# EAGLE schematic BEP32_6stencil_Seed_wMilling (EAGLE 6.4), part 2 of 4
## Sheet 5 of 12
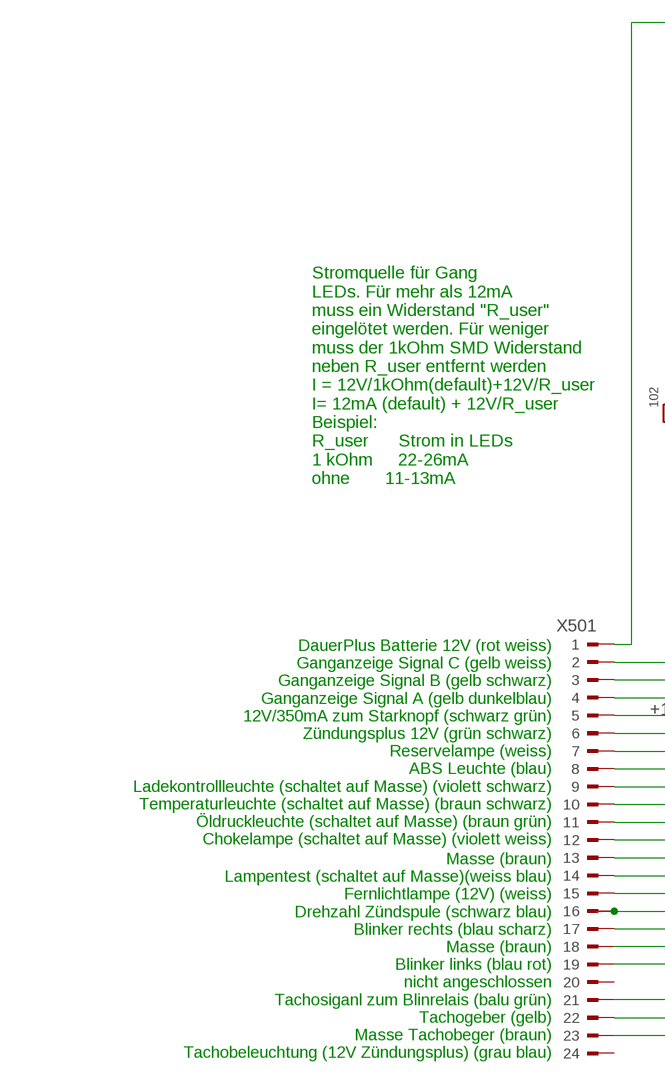
[diagram p8: schematic, sheet 5, part 1 of 2]
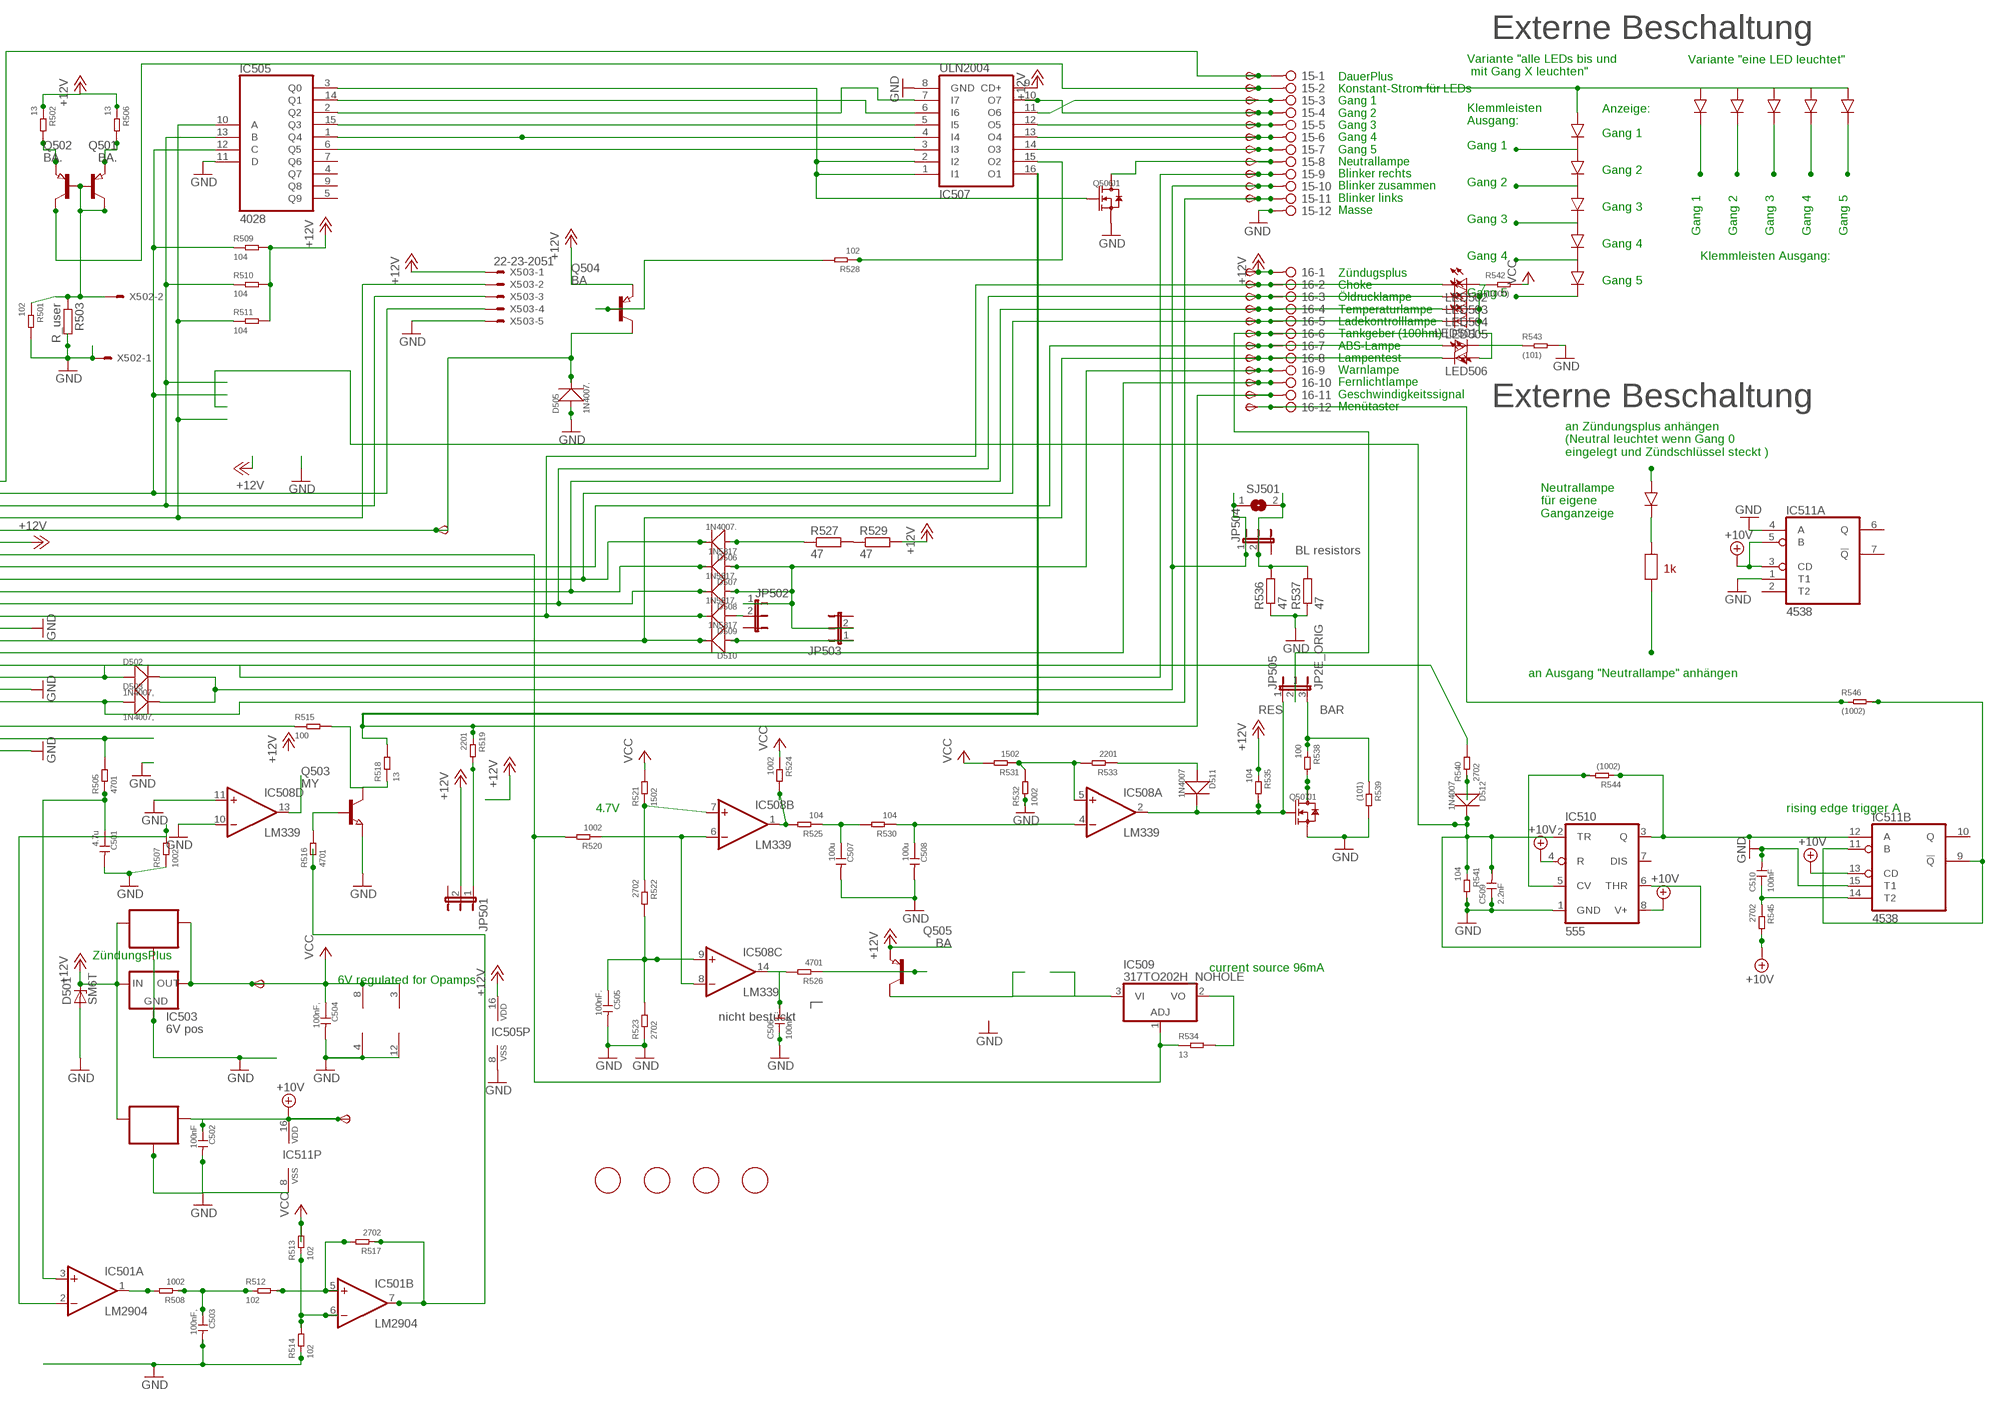
[diagram p9: schematic, sheet 5, part 2 of 2]

### Parts
6V501  TPSB2.0  [B2.0]
10V501  TPSB2.0  [B2.0]
15  2081-1132  [12-PIN]
16  2081-1132  [12-PIN]
C501  4.7u  CERAMIC-4.7UF-25V-10%-X5R(0805)  [C0805]
C502  100nF  CERAMIC-100NF-50V-10%-X7R(0805)  [C0805]
C503  100nF,  CERAMIC-100NF-50V-10%-X7R(0805)  [C0805]
C504  100nF,  CERAMIC-100NF-50V-10%-X7R(0805)  [C0805]
C505  100nF.  CERAMIC-100NF-50V-10%-X7R(0805)  [C0805]
C506  100nF.  CERAMIC-100NF-50V-10%-X7R(0805)  [C0805]
C507  100u  CERAMIC-100UF-6.3V-20%-X5R(1206)  [C1206]
C508  100u  CERAMIC-100UF-6.3V-20%-X5R(1206)  [C1206]
C509  2.2nF  CERAMIC-100NF-50V-10%-X7R(0805)  [C0805]
C510  100nF  CERAMIC-100NF-50V-10%-X7R(0805)  [C0805]
D501  SM6T  [DO214AA]
D502  1N4007,  DIODE-GEN-PURPOSE-1KV-1A(DO-214AC)  [DO-214AC]
D503  1N4007,  DIODE-GEN-PURPOSE-1KV-1A(DO-214AC)  [DO-214AC]
D505  1N4007.  DIODE-GEN-PURPOSE-1KV-1A(DO-214AC)  [DO-214AC]
D506  1N4007.  DIODE-GEN-PURPOSE-1KV-1A(DO-214AC)  [DO-214AC]
D507  1N5817  DIODE-GEN-PURPOSE-1KV-1A(DO-214AC)DO-214AC/1206  [DO-214AC_SLIM]
D508  1N5817.  DIODE-GEN-PURPOSE-1KV-1A(DO-214AC)DO-214AC/1206  [DO-214AC_SLIM]
D509  1N5817.  DIODE-GEN-PURPOSE-1KV-1A(DO-214AC)DO-214AC/1206  [DO-214AC_SLIM]
D510  1N5817  DIODE-GEN-PURPOSE-1KV-1A(DO-214AC)DO-214AC/1206  [DO-214AC_SLIM]
D511  1N4007  DIODE-GEN-PURPOSE-1KV-1A(DO-214AC)  [DO-214AC]
D512  1N4007  DIODE-GEN-PURPOSE-1KV-1A(DO-214AC)  [DO-214AC]
FID501  FIDUCIAL  [FIDUCIAL_1MM]
FID502  FIDUCIAL  [FIDUCIAL_1MM]
FID503  FIDUCIAL  [FIDUCIAL_1MM]
FID504  FIDUCIAL  [FIDUCIAL_1MM]
IC501  LM2904  LM358D  [SO08]
IC502  78L06  78LXXSOT89_ROUND  [SOT89_ROUND]
IC503  6V pos  78LXX  [78LXX]
IC504  78L10  78LXXSOT89_ROUND  [SOT89_ROUND]
IC505  4028  4028D  [SO16]
IC507  ULN2004  ULN2004AD  [SO16]
IC508  LM339  LM339D  [SO14]
IC509  317TO202H_NOHOLE  [TO220H_NOHOLE]
IC510  555  NE555D  [SO08]
IC511  4538  4538D  [SO16]
JP501  JP2EJP2_SMALLPADS  [JP2_SMALLPADS]
JP502  JP2EJP2_SMALLPADS  [JP2_SMALLPADS]
JP503  JP2EJP2_SMALLPADS  [JP2_SMALLPADS]
JP504  JP2EJP2_SMALLPADS  [JP2_SMALLPADS]
JP505  JP2E_ORIG  [JP2_ORIG_SMALLPADS]
LED501  LEDLD260  [LD260]
LED502  LEDLD260  [LD260]
LED503  LEDLD260  [LD260]
LED504  LEDLD260  [LD260]
LED505  LEDLD260  [LD260]
LED506  LEDLD260  [LD260]
Q501  BA.  PNP-TRANSISTOR_SOT89  [SOT89]
Q502  BA.  PNP-TRANSISTOR_SOT89  [SOT89]
Q503  MY  NPN-TRANSISTOR_SOT89  [SOT89]
Q504  BA  PNP-TRANSISTOR_SOT89  [SOT89]
Q505  BA  PNP-TRANSISTOR_SOT89  [SOT89]
Q506  J1  SMD-MOSFET-N-CH-50V-200MA-BSS138W-7-F(SOT-23)  [SOT-23]
Q507  J1  SMD-MOSFET-N-CH-50V-200MA-BSS138W-7-F(SOT-23)  [SOT-23]
R501  102  SMD-RES-1K-5%-1/8W(0805)  [R0805]
R502  13  SMD-RES-13R-5%-1/4W(1206)  [R1206]
R503  R_user  R-EU_R0805  [R0805]
R505  4701  SMD-RES-4.7K-5%-1/8W(0805)  [R0805]
R506  13  SMD-RES-13R-5%-1/4W(1206)  [R1206]
R507  1002  SMD-RES-10K-1%-1/8W(0805)  [R0805]
R508  1002  SMD-RES-10K-1%-1/8W(0805)  [R0805]
R509  104  SMD-RES-10K-1%-1/8W(0805)  [R0805]
R510  104  SMD-RES-10K-1%-1/8W(0805)  [R0805]
R511  104  SMD-RES-10K-1%-1/8W(0805)  [R0805]
R512  102  SMD-RES-1K-5%-1/8W(0805)  [R0805]
R513  102  SMD-RES-1K-5%-1/8W(0805)  [R0805]
R514  102  SMD-RES-1K-5%-1/8W(0805)  [R0805]
R515  100  SMD-RES-220R-5%-1/8W(0805)  [R0805]
R516  4701  SMD-RES-4.7K-5%-1/8W(0805)  [R0805]
R517  2702  SMD-RES-4.7K-5%-1/8W(0805)  [R0805]
R518  13  SMD-RES-13R-5%-1/4W(1206)  [R1206]
R519  2201  SMD-RES-2.2K-5%-1/8W(0805)  [R0805]
R520  1002  SMD-RES-10K-1%-1/8W(0805)  [R0805]
R521  1502  SMD-RES-10K-1%-1/8W(0805)  [R0805]
R522  2702  SMD-RES-4.7K-5%-1/8W(0805)  [R0805]
R523  2702  SMD-RES-4.7K-5%-1/8W(0805)  [R0805]
R524  1002  SMD-RES-10K-1%-1/8W(0805)  [R0805]
R525  104  SMD-RES-10K-1%-1/8W(0805)  [R0805]
R526  4701  SMD-RES-4.7K-5%-1/8W(0805)  [R0805]
R527  47  R-EU_V235/17_1MM  [V235/17_1MM]
R528  102  SMD-RES-1K-5%-1/8W(0805)  [R0805]
R529  47  R-EU_V235/17_1MM  [V235/17_1MM]
R530  104  SMD-RES-10K-1%-1/8W(0805)  [R0805]
R531  1502  SMD-RES-10K-1%-1/8W(0805)  [R0805]
R532  1002  SMD-RES-10K-1%-1/8W(0805)  [R0805]
R533  2201  SMD-RES-2.2K-5%-1/8W(0805)  [R0805]
R534  13  SMD-RES-13R-5%-1/4W(1206)  [R1206]
R535  104  SMD-RES-10K-1%-1/8W(0805)  [R0805]
R536  47  R-EU_V235/17_1MM  [V235/17_1MM]
R537  47  R-EU_V235/17_1MM  [V235/17_1MM]
R538  100  SMD-RES-2.2K-5%-1/8W(0805)  [R0805]
R539  (101)  SMD-RES-2.2K-5%-1/8W(0805)  [R0805]
R540  2702  SMD-RES-10K-1%-1/8W(0805)  [R0805]
R541  104  SMD-RES-10K-1%-1/8W(0805)  [R0805]
R542  (1000)  SMD-RES-100R-5%-1/8W(0805)  [R0805]
R543  (101)  SMD-RES-100R-5%-1/8W(0805)  [R0805]
R544  (1002)  SMD-RES-10K-1%-1/8W(0805)  [R0805]
R545  2702  SMD-RES-4.7K-5%-1/8W(0805)  [R0805]
R546  (1002)  SMD-RES-4.7K-5%-1/8W(0805)  [R0805]
SJ501  SJ  [SJ]
START501  TPSB2.0  [B2.0]
TP162  TPSB2.0  [B2.0]
TP163  TPSB2.0  [B2.0]
TP164  TPSB2.0  [B2.0]
TP165  TPSB2.0  [B2.0]
TP166  TPSB2.0  [B2.0]
TP167  TPSB2.0  [B2.0]
TP168  TPSB2.0  [B2.0]
TP169  TPSB2.0  [B2.0]
TP170  TPSB2.0  [B2.0]
TP171  TPSB2.0  [B2.0]
TP172  TPSB2.0  [B2.0]
TP173  TPSB2.0  [B2.0]
TP174  TPSB2.0  [B2.0]
TP175  TPSB2.0  [B2.0]
TP176  TPSB2.0  [B2.0]
TP177  TPSB2.0  [B2.0]
TP178  TPSB2.0  [B2.0]
TP179  TPSB2.0  [B2.0]
TP180  TPSB1,27  [B1,27]
TP181  TPSB2.0  [B2.0]
TP182  TPSB2.0  [B2.0]
TP183  TPSB2.0  [B2.0]
TP184  TPSB2.0  [B2.0]
X501  CON_BMWV2  [24-PIN_V2]
X502  22-23-2021  [22-23-2021]
X503  22-23-2051  [22-23-2051]

### Nets
+10V: 10V501.TP(PP) C502.1 IC504.1(OUT) IC510.4(R) IC510.8(V+) IC511.3(A:CD) IC511.5(A:B) IC511.13(B:CD) IC511.16(P:VDD) R545.2 ; also sheet 1,2,3,4,6,7,8,9,10,11,12
+12V: 16.1 D501.C IC502.3(IN) IC503.IN IC504.3(IN) IC505.16(VDD) IC507.9(CD+) JP501.2 Q504.3(E) Q505.3(E) R502.1 R506.1 R509.2 R510.2 R511.2 R529.2 R535.1 TP183.TP(PP) X501.6 X503.1 ; also sheet 1,2,3,4,6,7,8,9,10,11,12
+12V8: IC501.7(B:OUT) R516.1 R517.1
GND: 15.12 C501.2 C502.2 C503.2 C504.2 C505.2 C506.1 C507.2 C508.2 C509.1 C510.2 D501.A D505.1(+) IC501.4(P:V-) IC502.2(GND) IC502.2@1(GND) IC503.GND IC504.2(GND) IC504.2@1(GND) IC505.8(VSS) IC505.11(D) IC507.8(GND) IC508.10(D:-IN) IC508.11(D:+IN) IC508.12(P:GND) IC510.1(GND) IC511.1(A:T1) IC511.4(A:A) IC511.8(P:VSS) IC511.15(B:T1) Q503.3(E) Q506.2(S) Q507.2(S) R501.2 R503.2 R507.1 R514.1 R523.1 R532.1 R536.1 R537.1 R539.2 R541.2 R543.2 X501.13 X501.18 X501.23 X502.1 X503.5 ; also sheet 1,2,3,4,6,7,8,9,10,11,12
N$687: R527.2 R529.1
N$688: 16.9 D507.1(+) D508.1(+) JP502.1 JP503.2 TP180.TP(PP)
N$689: IC505.10(A) R511.1 X501.4 X503.2
N$690: IC505.13(B) R510.1 X501.3 X503.3
N$691: D505.2(-) Q504.2(C) START501.TP(PP) X501.5
N$692: IC505.12(C) R509.1 X501.2 X503.4
N$693: 16.7 LED501.A TP178.TP(PP) X501.8
N$694: 16.2 D509.2(-) LED502.K(C) TP173.TP(PP) X501.12
N$695: 16.3 D508.2(-) LED503.K(C) TP174.TP(PP) X501.11
N$696: 16.4 D507.2(-) LED504.K(C) TP175.TP(PP) X501.10
N$697: 16.8 D510.2(-) LED506.K(C) TP179.TP(PP) X501.14
N$698: 15.9 D502.1(+) TP170.TP(PP) X501.17
N$699: 15.11 D503.1(+) TP172.TP(PP) X501.19
N$700: R505.2 X501.22
N$701: C501.1 IC501.3(A:+IN) R505.1
N$702: 16.11 IC507.16(O1) R518.2 R519.1 TP182.TP(PP)
N$703: IC508.1(B:OUT) R524.2 R525.2
N$704: C507.1 R525.1 R530.2
N$705: C508.1 IC508.4(A:-IN) R530.1
N$706: IC508.5(A:+IN) R531.1 R532.2 R533.2
N$707: D511.1(+) R533.1
N$708: C505.1 IC508.9(C:+IN) R522.2 R523.2
N$709: C506.2 IC508.14(C:OUT) R526.2
N$710: Q505.1(B) R526.1
N$711: IC505.2(Q2) IC507.7(I7)
N$712: 15.5 IC507.12(O5) TP166.TP(PP)
N$713: IC505.1(Q4) IC507.4(I4)
N$714: 15.8 Q506.3(D) TP169.TP(PP)
N$715: 16.10 TP181.TP(PP) X501.15
N$716: 16.5 D506.2(-) LED505.K(C) TP176.TP(PP) X501.9
N$717: D506.1(+) R527.1
N$718: IC505.6(Q5) IC507.3(I3)
N$719: 15.4 IC507.10(O7) TP165.TP(PP)
N$720: IC509.1(ADJ) R520.2 R534.1 X501.7
N$721: IC508.6(B:-IN) IC508.8(C:-IN) R520.1
N$722: 15.2 Q501.2(C) TP163.TP(PP)
N$723: 15.1 TP162.TP(PP) X501.1
N$737: R540.2 X501.16
N$738: IC505.15(Q3) IC507.5(I5)
N$739: 15.6 IC507.13(O4) TP167.TP(PP)
N$740: 15.7 IC507.14(O3) TP168.TP(PP)
N$741: 16.6 JP505.2 TP177.TP(PP)
N$742: LED501.K(C) R543.1
N$743: LED502.A LED503.A LED504.A LED505.A LED506.A R542.1
N$744: Q504.1(B) R528.2
N$745: IC505.3(Q0) IC507.1(I1) IC507.2(I2) Q506.1(G)
N$746: IC505.14(Q1) IC507.6(I6)
N$747: 15.3 IC507.11(O6) TP164.TP(PP)
N$748: Q501.1(B) Q502.1(B) Q502.2(C) R501.1 R503.1 X502.2
N$749: Q501.3(E) R502.2
N$750: Q502.3(E) R506.2
N$751: IC508.7(B:+IN) R521.1 R522.1
N$752: IC501.2(A:-IN) R507.2
N$753: Q503.1(B) R516.2
N$754: Q507.3(D) R538.2
N$755: IC509.2(VO) R534.2
N$756: IC509.3(VI) Q505.2(C)
N$757: C509.2 D512.2(-) IC510.2(TR) IC510.6(THR) R541.1
N$758: IC510.5(CV) R544.2
N$759: IC510.3(Q) IC511.12(B:A) R544.1
N$760: D512.1(+) R540.1
N$761: 15.10 D502.2(-) D503.2(-) JP504.1 SJ501.1 TP171.TP(PP)
N$762: JP504.2 R536.2 R537.2 SJ501.2
N$763: IC511.9(B:!Q) IC511.11(B:B) R546.2
N$764: C510.1 IC511.14(B:T2) R545.1
N$765: JP501.1 R519.2
N$766: IC507.15(O2) R528.1
N$767: 16.12 R546.1 TP184.TP(PP)
N$768: D509.1(+) JP502.2
N$769: D511.2(-) IC508.2(A:OUT) JP505.1 Q507.1(G) R535.2
N$770: IC501.1(A:OUT) R508.2
N$771: C503.1 R508.1 R512.1
N$772: IC501.5(B:+IN) R512.2 R517.2
N$773: IC501.6(B:-IN) R513.1 R514.2
N$774: D510.1(+) JP503.1
N$775: JP505.3 R538.1 R539.1
N$776: IC508.13(D:OUT)
N$777: R515.1 X501.21
N$778: Q503.2(C) R515.2 R518.1
VCC: 6V501.TP(PP) C504.1 IC501.8(P:V+) IC502.1(OUT) IC503.OUT IC508.3(P:V+) R513.2 R521.2 R524.1 R531.2 R542.2 ; also sheet 1,2,3,4,6,7,8,9,10,11,12
Unconnected: IC505.4(Q7) IC505.5(Q9) IC505.7(Q6) IC505.9(Q8) IC510.7(DIS) IC511.2(A:T2) IC511.6(A:Q) IC511.7(A:!Q) IC511.10(B:Q) X501.20 X501.24

### Notes on the sheet
- Externe Beschaltung
- Variante "eine LED leuchtet"
- Variante "alle LEDs bis und
   mit Gang X leuchten"
- Anzeige:
- Klemmleisten
  Ausgang:
- Gang 1
- DauerPlus
  Konstant-Strom für LEDs
  Gang 1
  Gang 2
  Gang 3
  Gang 4
  Gang 5
  Neutrallampe
  Blinker rechts
  Blinker zusammen
  Blinker links
  Masse
- Gang 1
- Gang 2
- Gang 2
- Gang 3
- Gang 3
- Gang 1 | Gang 2 | Gang 3 | Gang 4 | Gang 5
- Gang 4
- Gang 4 | Klemmleisten Ausgang:
- Gang 5
- Gang 5
- Zündugsplus
  Choke
  Öldrucklampe
  Temperaturlampe
  Ladekontrolllampe
  Tankgeber (100hm)
  ABS-Lampe
  Lampentest
  Warnlampe
  Fernlichtlampe
  Geschwindigkeitssignal
  Menütaster
- Stromquelle für Gang
  LEDs. Für mehr als 12mA
  muss ein Widerstand "R_user"
  eingelötet werden. Für weniger
  muss der 1kOhm SMD Widerstand
  neben R_user entfernt werden
  I = 12V/1kOhm(default)+12V/R_user
  I= 12mA (default) + 12V/R_user
  Beispiel:
  R_user      Strom in LEDs
  1 kOhm     22-26mA
  ohne       11-13mA
- Externe Beschaltung
- an Zündungsplus anhängen
  (Neutral leuchtet wenn Gang 0
  eingelegt und Zündschlüssel steckt )
- Neutrallampe
  für eigene
  Ganganzeige
- DauerPlus Batterie 12V (rot weiss)
  Ganganzeige Signal C (gelb weiss)
  Ganganzeige Signal B (gelb schwarz)
  Ganganzeige Signal A (gelb dunkelblau)
  12V/350mA zum Starknopf (schwarz grün)
  Zündungsplus 12V (grün schwarz)
  Reservelampe (weiss)
  ABS Leuchte (blau)
  Ladekontrollleuchte (schaltet auf Masse) (violett schwarz)
  Temperaturleuchte (schaltet auf Masse) (braun schwarz)
  Öldruckleuchte (schaltet auf Masse) (braun grün)
  Chokelampe (schaltet auf Masse) (violett weiss)
- BL resistors
- 1k
- an Ausgang "Neutrallampe" anhängen
- Masse (braun)
  Lampentest (schaltet auf Masse)(weiss blau)
  Fernlichtlampe (12V) (weiss)
  Drehzahl Zündspule (schwarz blau)
  Blinker rechts (blau scharz)
  Masse (braun)
  Blinker links (blau rot)
  nicht angeschlossen
  Tachosiganl zum Blinrelais (balu grün)
  Tachogeber (gelb)
  Masse Tachobeger (braun)
  Tachobeleuchtung (12V Zündungsplus) (grau blau)
- RES | BAR
- 4.7V | rising edge trigger A
- ZündungsPlus
- current source 96mA
- 6V regulated for Opamps
- nicht bestückt

## Sheet 6 of 12
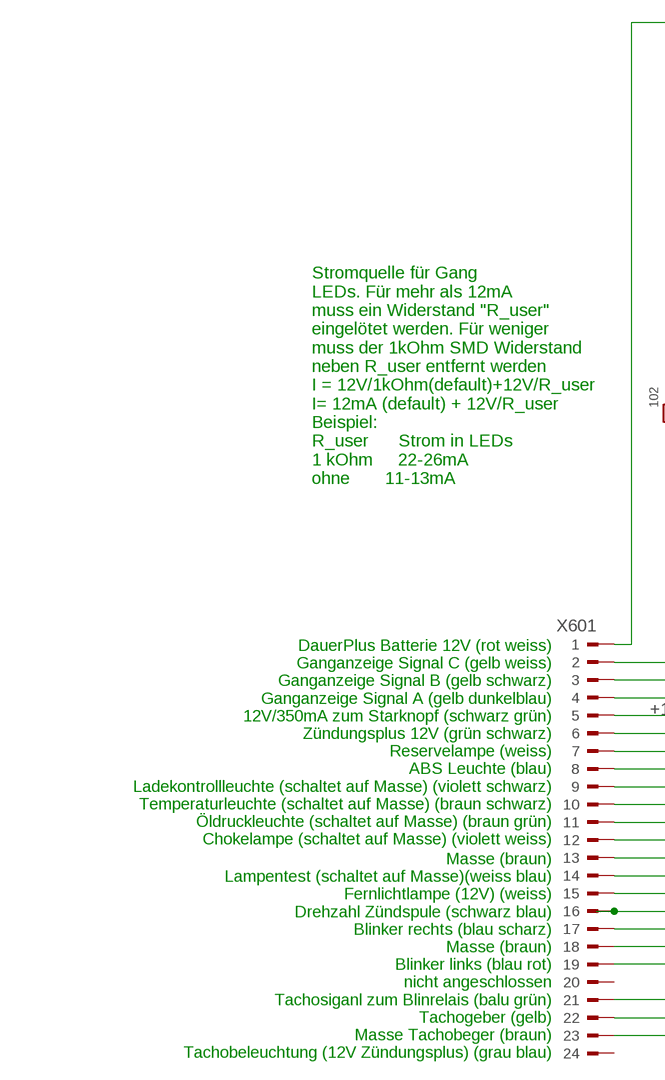
[diagram p10: schematic, sheet 6, part 1 of 2]
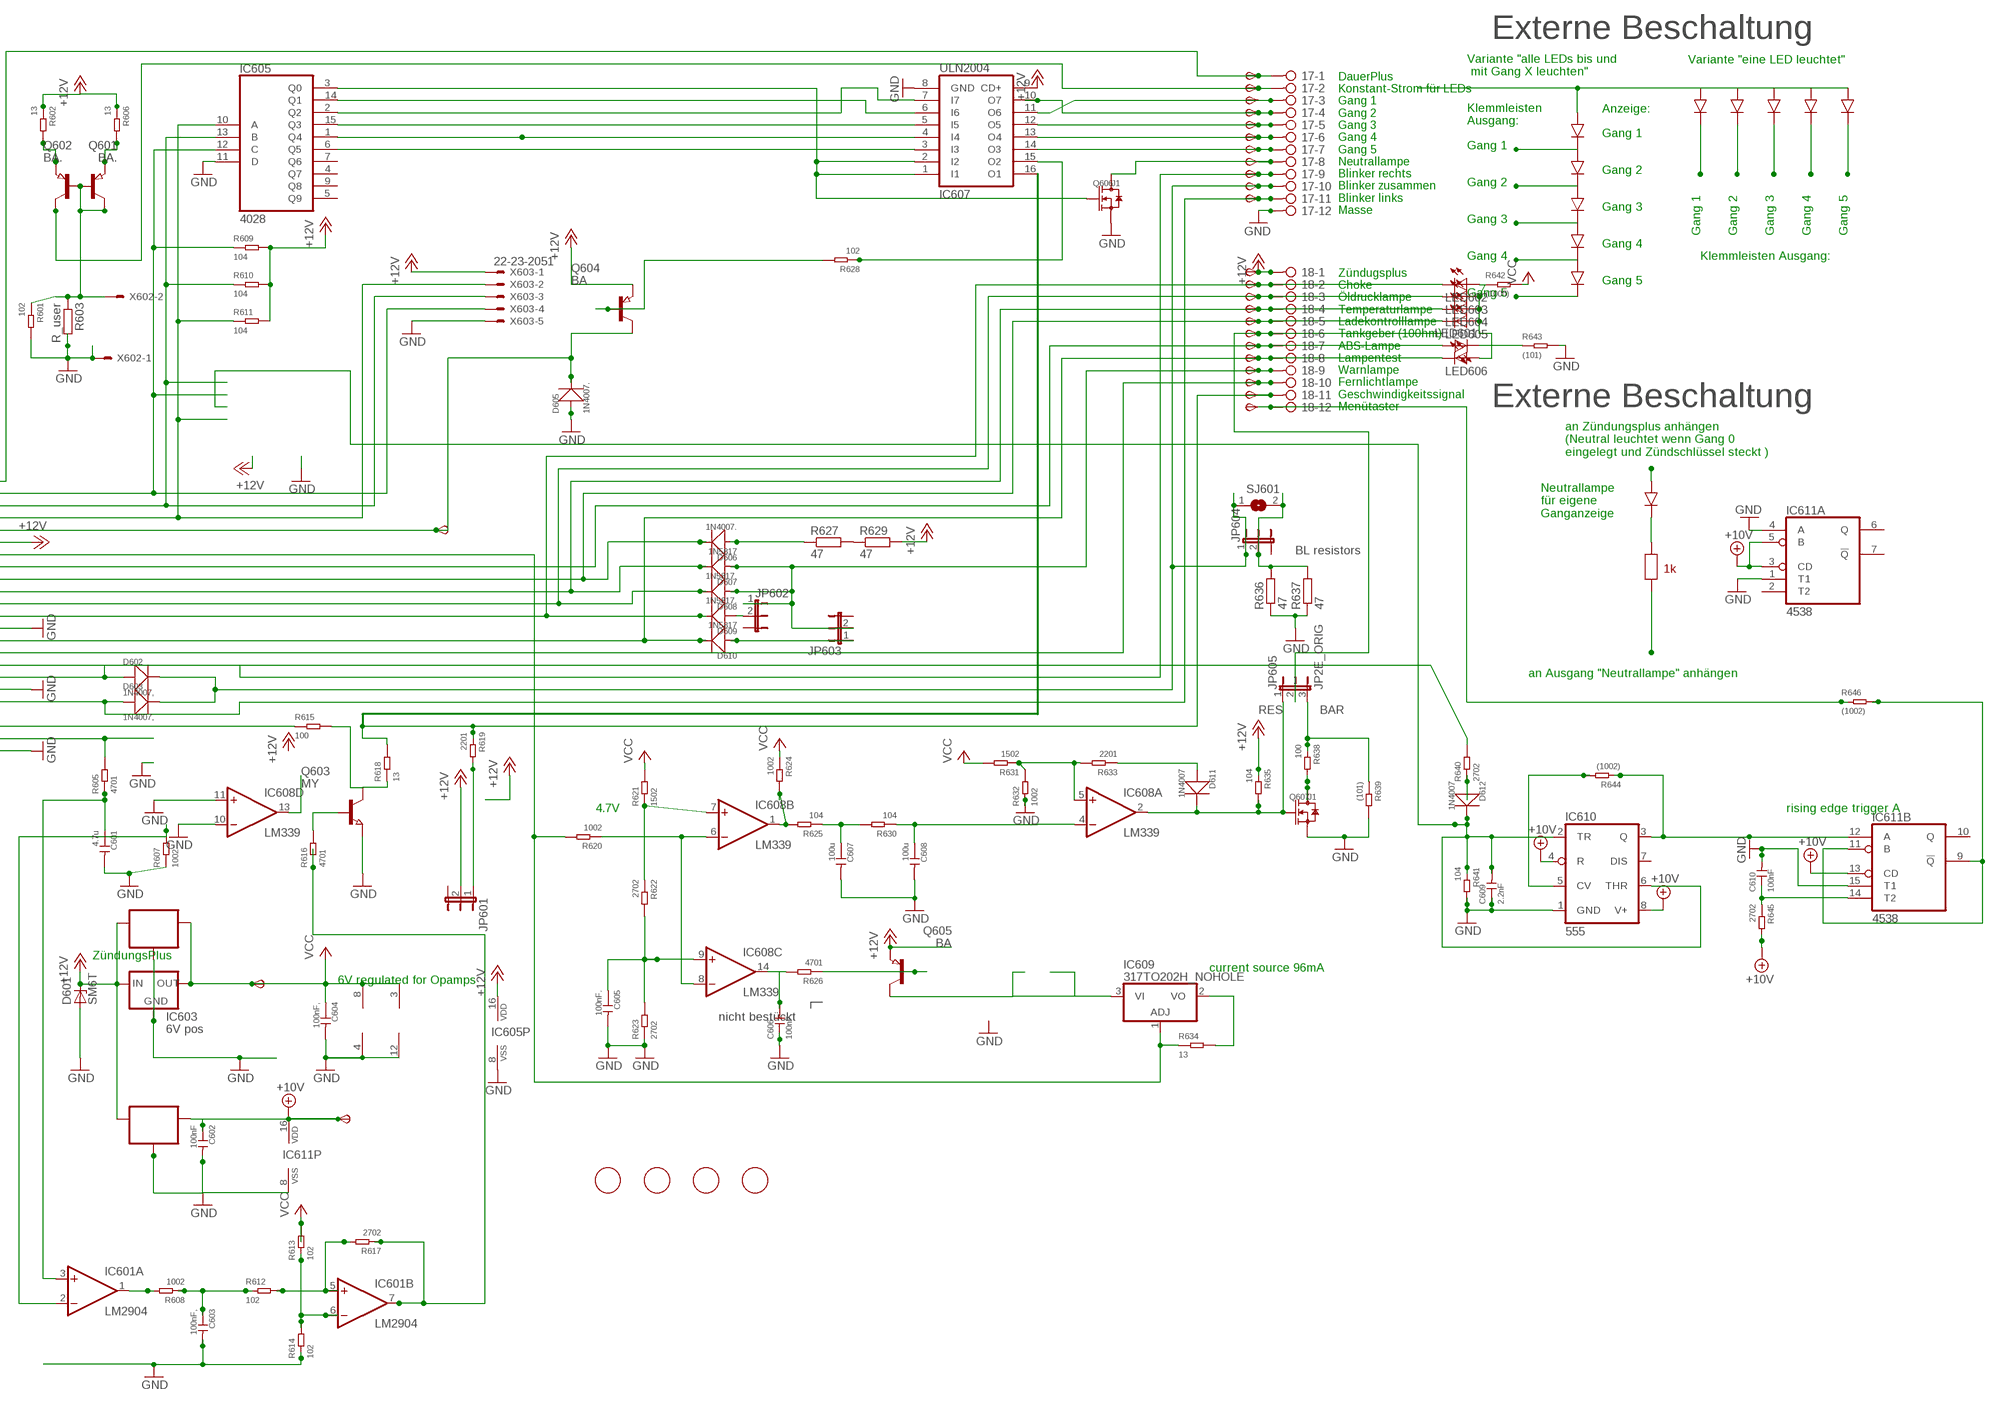
[diagram p11: schematic, sheet 6, part 2 of 2]

### Parts
6V601  TPSB2.0  [B2.0]
10V601  TPSB2.0  [B2.0]
17  2081-1132  [12-PIN]
18  2081-1132  [12-PIN]
C601  4.7u  CERAMIC-4.7UF-25V-10%-X5R(0805)  [C0805]
C602  100nF  CERAMIC-100NF-50V-10%-X7R(0805)  [C0805]
C603  100nF,  CERAMIC-100NF-50V-10%-X7R(0805)  [C0805]
C604  100nF,  CERAMIC-100NF-50V-10%-X7R(0805)  [C0805]
C605  100nF.  CERAMIC-100NF-50V-10%-X7R(0805)  [C0805]
C606  100nF.  CERAMIC-100NF-50V-10%-X7R(0805)  [C0805]
C607  100u  CERAMIC-100UF-6.3V-20%-X5R(1206)  [C1206]
C608  100u  CERAMIC-100UF-6.3V-20%-X5R(1206)  [C1206]
C609  2.2nF  CERAMIC-100NF-50V-10%-X7R(0805)  [C0805]
C610  100nF  CERAMIC-100NF-50V-10%-X7R(0805)  [C0805]
D601  SM6T  [DO214AA]
D602  1N4007,  DIODE-GEN-PURPOSE-1KV-1A(DO-214AC)  [DO-214AC]
D603  1N4007,  DIODE-GEN-PURPOSE-1KV-1A(DO-214AC)  [DO-214AC]
D605  1N4007.  DIODE-GEN-PURPOSE-1KV-1A(DO-214AC)  [DO-214AC]
D606  1N4007.  DIODE-GEN-PURPOSE-1KV-1A(DO-214AC)  [DO-214AC]
D607  1N5817  DIODE-GEN-PURPOSE-1KV-1A(DO-214AC)DO-214AC/1206  [DO-214AC_SLIM]
D608  1N5817.  DIODE-GEN-PURPOSE-1KV-1A(DO-214AC)DO-214AC/1206  [DO-214AC_SLIM]
D609  1N5817.  DIODE-GEN-PURPOSE-1KV-1A(DO-214AC)DO-214AC/1206  [DO-214AC_SLIM]
D610  1N5817  DIODE-GEN-PURPOSE-1KV-1A(DO-214AC)DO-214AC/1206  [DO-214AC_SLIM]
D611  1N4007  DIODE-GEN-PURPOSE-1KV-1A(DO-214AC)  [DO-214AC]
D612  1N4007  DIODE-GEN-PURPOSE-1KV-1A(DO-214AC)  [DO-214AC]
FID601  FIDUCIAL  [FIDUCIAL_1MM]
FID602  FIDUCIAL  [FIDUCIAL_1MM]
FID603  FIDUCIAL  [FIDUCIAL_1MM]
FID604  FIDUCIAL  [FIDUCIAL_1MM]
IC601  LM2904  LM358D  [SO08]
IC602  78L06  78LXXSOT89_ROUND  [SOT89_ROUND]
IC603  6V pos  78LXX  [78LXX]
IC604  78L10  78LXXSOT89_ROUND  [SOT89_ROUND]
IC605  4028  4028D  [SO16]
IC607  ULN2004  ULN2004AD  [SO16]
IC608  LM339  LM339D  [SO14]
IC609  317TO202H_NOHOLE  [TO220H_NOHOLE]
IC610  555  NE555D  [SO08]
IC611  4538  4538D  [SO16]
JP601  JP2EJP2_SMALLPADS  [JP2_SMALLPADS]
JP602  JP2EJP2_SMALLPADS  [JP2_SMALLPADS]
JP603  JP2EJP2_SMALLPADS  [JP2_SMALLPADS]
JP604  JP2EJP2_SMALLPADS  [JP2_SMALLPADS]
JP605  JP2E_ORIG  [JP2_ORIG_SMALLPADS]
LED601  LEDLD260  [LD260]
LED602  LEDLD260  [LD260]
LED603  LEDLD260  [LD260]
LED604  LEDLD260  [LD260]
LED605  LEDLD260  [LD260]
LED606  LEDLD260  [LD260]
Q601  BA.  PNP-TRANSISTOR_SOT89  [SOT89]
Q602  BA.  PNP-TRANSISTOR_SOT89  [SOT89]
Q603  MY  NPN-TRANSISTOR_SOT89  [SOT89]
Q604  BA  PNP-TRANSISTOR_SOT89  [SOT89]
Q605  BA  PNP-TRANSISTOR_SOT89  [SOT89]
Q606  J1  SMD-MOSFET-N-CH-50V-200MA-BSS138W-7-F(SOT-23)  [SOT-23]
Q607  J1  SMD-MOSFET-N-CH-50V-200MA-BSS138W-7-F(SOT-23)  [SOT-23]
R601  102  SMD-RES-1K-5%-1/8W(0805)  [R0805]
R602  13  SMD-RES-13R-5%-1/4W(1206)  [R1206]
R603  R_user  R-EU_R0805  [R0805]
R605  4701  SMD-RES-4.7K-5%-1/8W(0805)  [R0805]
R606  13  SMD-RES-13R-5%-1/4W(1206)  [R1206]
R607  1002  SMD-RES-10K-1%-1/8W(0805)  [R0805]
R608  1002  SMD-RES-10K-1%-1/8W(0805)  [R0805]
R609  104  SMD-RES-10K-1%-1/8W(0805)  [R0805]
R610  104  SMD-RES-10K-1%-1/8W(0805)  [R0805]
R611  104  SMD-RES-10K-1%-1/8W(0805)  [R0805]
R612  102  SMD-RES-1K-5%-1/8W(0805)  [R0805]
R613  102  SMD-RES-1K-5%-1/8W(0805)  [R0805]
R614  102  SMD-RES-1K-5%-1/8W(0805)  [R0805]
R615  100  SMD-RES-220R-5%-1/8W(0805)  [R0805]
R616  4701  SMD-RES-4.7K-5%-1/8W(0805)  [R0805]
R617  2702  SMD-RES-4.7K-5%-1/8W(0805)  [R0805]
R618  13  SMD-RES-13R-5%-1/4W(1206)  [R1206]
R619  2201  SMD-RES-2.2K-5%-1/8W(0805)  [R0805]
R620  1002  SMD-RES-10K-1%-1/8W(0805)  [R0805]
R621  1502  SMD-RES-10K-1%-1/8W(0805)  [R0805]
R622  2702  SMD-RES-4.7K-5%-1/8W(0805)  [R0805]
R623  2702  SMD-RES-4.7K-5%-1/8W(0805)  [R0805]
R624  1002  SMD-RES-10K-1%-1/8W(0805)  [R0805]
R625  104  SMD-RES-10K-1%-1/8W(0805)  [R0805]
R626  4701  SMD-RES-4.7K-5%-1/8W(0805)  [R0805]
R627  47  R-EU_V235/17_1MM  [V235/17_1MM]
R628  102  SMD-RES-1K-5%-1/8W(0805)  [R0805]
R629  47  R-EU_V235/17_1MM  [V235/17_1MM]
R630  104  SMD-RES-10K-1%-1/8W(0805)  [R0805]
R631  1502  SMD-RES-10K-1%-1/8W(0805)  [R0805]
R632  1002  SMD-RES-10K-1%-1/8W(0805)  [R0805]
R633  2201  SMD-RES-2.2K-5%-1/8W(0805)  [R0805]
R634  13  SMD-RES-13R-5%-1/4W(1206)  [R1206]
R635  104  SMD-RES-10K-1%-1/8W(0805)  [R0805]
R636  47  R-EU_V235/17_1MM  [V235/17_1MM]
R637  47  R-EU_V235/17_1MM  [V235/17_1MM]
R638  100  SMD-RES-2.2K-5%-1/8W(0805)  [R0805]
R639  (101)  SMD-RES-2.2K-5%-1/8W(0805)  [R0805]
R640  2702  SMD-RES-10K-1%-1/8W(0805)  [R0805]
R641  104  SMD-RES-10K-1%-1/8W(0805)  [R0805]
R642  (1000)  SMD-RES-100R-5%-1/8W(0805)  [R0805]
R643  (101)  SMD-RES-100R-5%-1/8W(0805)  [R0805]
R644  (1002)  SMD-RES-10K-1%-1/8W(0805)  [R0805]
R645  2702  SMD-RES-4.7K-5%-1/8W(0805)  [R0805]
R646  (1002)  SMD-RES-4.7K-5%-1/8W(0805)  [R0805]
SJ601  SJ  [SJ]
START601  TPSB2.0  [B2.0]
TP185  TPSB2.0  [B2.0]
TP186  TPSB2.0  [B2.0]
TP187  TPSB2.0  [B2.0]
TP188  TPSB2.0  [B2.0]
TP189  TPSB2.0  [B2.0]
TP190  TPSB2.0  [B2.0]
TP191  TPSB2.0  [B2.0]
TP192  TPSB2.0  [B2.0]
TP193  TPSB2.0  [B2.0]
TP194  TPSB2.0  [B2.0]
TP195  TPSB2.0  [B2.0]
TP196  TPSB2.0  [B2.0]
TP197  TPSB2.0  [B2.0]
TP198  TPSB2.0  [B2.0]
TP199  TPSB2.0  [B2.0]
TP200  TPSB2.0  [B2.0]
TP201  TPSB2.0  [B2.0]
TP202  TPSB2.0  [B2.0]
TP203  TPSB1,27  [B1,27]
TP204  TPSB2.0  [B2.0]
TP205  TPSB2.0  [B2.0]
TP206  TPSB2.0  [B2.0]
TP207  TPSB2.0  [B2.0]
X601  CON_BMWV2  [24-PIN_V2]
X602  22-23-2021  [22-23-2021]
X603  22-23-2051  [22-23-2051]

### Nets
+10V: 10V601.TP(PP) C602.1 IC604.1(OUT) IC610.4(R) IC610.8(V+) IC611.3(A:CD) IC611.5(A:B) IC611.13(B:CD) IC611.16(P:VDD) R645.2 ; also sheet 1,2,3,4,5,7,8,9,10,11,12
+12V: 18.1 D601.C IC602.3(IN) IC603.IN IC604.3(IN) IC605.16(VDD) IC607.9(CD+) JP601.2 Q604.3(E) Q605.3(E) R602.1 R606.1 R609.2 R610.2 R611.2 R629.2 R635.1 TP206.TP(PP) X601.6 X603.1 ; also sheet 1,2,3,4,5,7,8,9,10,11,12
+12V9: IC601.7(B:OUT) R616.1 R617.1
GND: 17.12 C601.2 C602.2 C603.2 C604.2 C605.2 C606.1 C607.2 C608.2 C609.1 C610.2 D601.A D605.1(+) IC601.4(P:V-) IC602.2(GND) IC602.2@1(GND) IC603.GND IC604.2(GND) IC604.2@1(GND) IC605.8(VSS) IC605.11(D) IC607.8(GND) IC608.10(D:-IN) IC608.11(D:+IN) IC608.12(P:GND) IC610.1(GND) IC611.1(A:T1) IC611.4(A:A) IC611.8(P:VSS) IC611.15(B:T1) Q603.3(E) Q606.2(S) Q607.2(S) R601.2 R603.2 R607.1 R614.1 R623.1 R632.1 R636.1 R637.1 R639.2 R641.2 R643.2 X601.13 X601.18 X601.23 X602.1 X603.5 ; also sheet 1,2,3,4,5,7,8,9,10,11,12
N$779: R627.2 R629.1
N$780: 18.9 D607.1(+) D608.1(+) JP602.1 JP603.2 TP203.TP(PP)
N$781: IC605.10(A) R611.1 X601.4 X603.2
N$782: IC605.13(B) R610.1 X601.3 X603.3
N$783: D605.2(-) Q604.2(C) START601.TP(PP) X601.5
N$784: IC605.12(C) R609.1 X601.2 X603.4
N$785: 18.7 LED601.A TP201.TP(PP) X601.8
N$786: 18.2 D609.2(-) LED602.K(C) TP196.TP(PP) X601.12
N$787: 18.3 D608.2(-) LED603.K(C) TP197.TP(PP) X601.11
N$788: 18.4 D607.2(-) LED604.K(C) TP198.TP(PP) X601.10
N$789: 18.8 D610.2(-) LED606.K(C) TP202.TP(PP) X601.14
N$790: 17.9 D602.1(+) TP193.TP(PP) X601.17
N$791: 17.11 D603.1(+) TP195.TP(PP) X601.19
N$792: R605.2 X601.22
N$793: C601.1 IC601.3(A:+IN) R605.1
N$794: 18.11 IC607.16(O1) R618.2 R619.1 TP205.TP(PP)
N$795: IC608.1(B:OUT) R624.2 R625.2
N$796: C607.1 R625.1 R630.2
N$797: C608.1 IC608.4(A:-IN) R630.1
N$798: IC608.5(A:+IN) R631.1 R632.2 R633.2
N$799: D611.1(+) R633.1
N$800: C605.1 IC608.9(C:+IN) R622.2 R623.2
N$801: C606.2 IC608.14(C:OUT) R626.2
N$802: Q605.1(B) R626.1
N$803: IC605.2(Q2) IC607.7(I7)
N$804: 17.5 IC607.12(O5) TP189.TP(PP)
N$805: IC605.1(Q4) IC607.4(I4)
N$806: 17.8 Q606.3(D) TP192.TP(PP)
N$807: 18.10 TP204.TP(PP) X601.15
N$808: 18.5 D606.2(-) LED605.K(C) TP199.TP(PP) X601.9
N$809: D606.1(+) R627.1
N$810: IC605.6(Q5) IC607.3(I3)
N$811: 17.4 IC607.10(O7) TP188.TP(PP)
N$812: IC609.1(ADJ) R620.2 R634.1 X601.7
N$813: IC608.6(B:-IN) IC608.8(C:-IN) R620.1
N$814: 17.2 Q601.2(C) TP186.TP(PP)
N$815: 17.1 TP185.TP(PP) X601.1
N$829: R640.2 X601.16
N$830: IC605.15(Q3) IC607.5(I5)
N$831: 17.6 IC607.13(O4) TP190.TP(PP)
N$832: 17.7 IC607.14(O3) TP191.TP(PP)
N$833: 18.6 JP605.2 TP200.TP(PP)
N$834: LED601.K(C) R643.1
N$835: LED602.A LED603.A LED604.A LED605.A LED606.A R642.1
N$836: Q604.1(B) R628.2
N$837: IC605.3(Q0) IC607.1(I1) IC607.2(I2) Q606.1(G)
N$838: IC605.14(Q1) IC607.6(I6)
N$839: 17.3 IC607.11(O6) TP187.TP(PP)
N$840: Q601.1(B) Q602.1(B) Q602.2(C) R601.1 R603.1 X602.2
N$841: Q601.3(E) R602.2
N$842: Q602.3(E) R606.2
N$843: IC608.7(B:+IN) R621.1 R622.1
N$844: IC601.2(A:-IN) R607.2
N$845: Q603.1(B) R616.2
N$846: Q607.3(D) R638.2
N$847: IC609.2(VO) R634.2
N$848: IC609.3(VI) Q605.2(C)
N$849: C609.2 D612.2(-) IC610.2(TR) IC610.6(THR) R641.1
N$850: IC610.5(CV) R644.2
N$851: IC610.3(Q) IC611.12(B:A) R644.1
N$852: D612.1(+) R640.1
N$853: 17.10 D602.2(-) D603.2(-) JP604.1 SJ601.1 TP194.TP(PP)
N$854: JP604.2 R636.2 R637.2 SJ601.2
N$855: IC611.9(B:!Q) IC611.11(B:B) R646.2
N$856: C610.1 IC611.14(B:T2) R645.1
N$857: JP601.1 R619.2
N$858: IC607.15(O2) R628.1
N$859: 18.12 R646.1 TP207.TP(PP)
N$860: D609.1(+) JP602.2
N$861: D611.2(-) IC608.2(A:OUT) JP605.1 Q607.1(G) R635.2
N$862: IC601.1(A:OUT) R608.2
N$863: C603.1 R608.1 R612.1
N$864: IC601.5(B:+IN) R612.2 R617.2
N$865: IC601.6(B:-IN) R613.1 R614.2
N$866: D610.1(+) JP603.1
N$867: JP605.3 R638.1 R639.1
N$868: IC608.13(D:OUT)
N$869: R615.1 X601.21
N$870: Q603.2(C) R615.2 R618.1
VCC: 6V601.TP(PP) C604.1 IC601.8(P:V+) IC602.1(OUT) IC603.OUT IC608.3(P:V+) R613.2 R621.2 R624.1 R631.2 R642.2 ; also sheet 1,2,3,4,5,7,8,9,10,11,12
Unconnected: IC605.4(Q7) IC605.5(Q9) IC605.7(Q6) IC605.9(Q8) IC610.7(DIS) IC611.2(A:T2) IC611.6(A:Q) IC611.7(A:!Q) IC611.10(B:Q) X601.20 X601.24

### Notes on the sheet
- Externe Beschaltung
- Variante "eine LED leuchtet"
- Variante "alle LEDs bis und
   mit Gang X leuchten"
- Anzeige:
- Klemmleisten
  Ausgang:
- Gang 1
- DauerPlus
  Konstant-Strom für LEDs
  Gang 1
  Gang 2
  Gang 3
  Gang 4
  Gang 5
  Neutrallampe
  Blinker rechts
  Blinker zusammen
  Blinker links
  Masse
- Gang 1
- Gang 2
- Gang 2
- Gang 3
- Gang 3
- Gang 1 | Gang 2 | Gang 3 | Gang 4 | Gang 5
- Gang 4
- Gang 4 | Klemmleisten Ausgang:
- Gang 5
- Gang 5
- Zündugsplus
  Choke
  Öldrucklampe
  Temperaturlampe
  Ladekontrolllampe
  Tankgeber (100hm)
  ABS-Lampe
  Lampentest
  Warnlampe
  Fernlichtlampe
  Geschwindigkeitssignal
  Menütaster
- Stromquelle für Gang
  LEDs. Für mehr als 12mA
  muss ein Widerstand "R_user"
  eingelötet werden. Für weniger
  muss der 1kOhm SMD Widerstand
  neben R_user entfernt werden
  I = 12V/1kOhm(default)+12V/R_user
  I= 12mA (default) + 12V/R_user
  Beispiel:
  R_user      Strom in LEDs
  1 kOhm     22-26mA
  ohne       11-13mA
- Externe Beschaltung
- an Zündungsplus anhängen
  (Neutral leuchtet wenn Gang 0
  eingelegt und Zündschlüssel steckt )
- Neutrallampe
  für eigene
  Ganganzeige
- DauerPlus Batterie 12V (rot weiss)
  Ganganzeige Signal C (gelb weiss)
  Ganganzeige Signal B (gelb schwarz)
  Ganganzeige Signal A (gelb dunkelblau)
  12V/350mA zum Starknopf (schwarz grün)
  Zündungsplus 12V (grün schwarz)
  Reservelampe (weiss)
  ABS Leuchte (blau)
  Ladekontrollleuchte (schaltet auf Masse) (violett schwarz)
  Temperaturleuchte (schaltet auf Masse) (braun schwarz)
  Öldruckleuchte (schaltet auf Masse) (braun grün)
  Chokelampe (schaltet auf Masse) (violett weiss)
- BL resistors
- 1k
- an Ausgang "Neutrallampe" anhängen
- Masse (braun)
  Lampentest (schaltet auf Masse)(weiss blau)
  Fernlichtlampe (12V) (weiss)
  Drehzahl Zündspule (schwarz blau)
  Blinker rechts (blau scharz)
  Masse (braun)
  Blinker links (blau rot)
  nicht angeschlossen
  Tachosiganl zum Blinrelais (balu grün)
  Tachogeber (gelb)
  Masse Tachobeger (braun)
  Tachobeleuchtung (12V Zündungsplus) (grau blau)
- RES | BAR
- 4.7V | rising edge trigger A
- ZündungsPlus
- current source 96mA
- 6V regulated for Opamps
- nicht bestückt

## Sheet 7 of 12
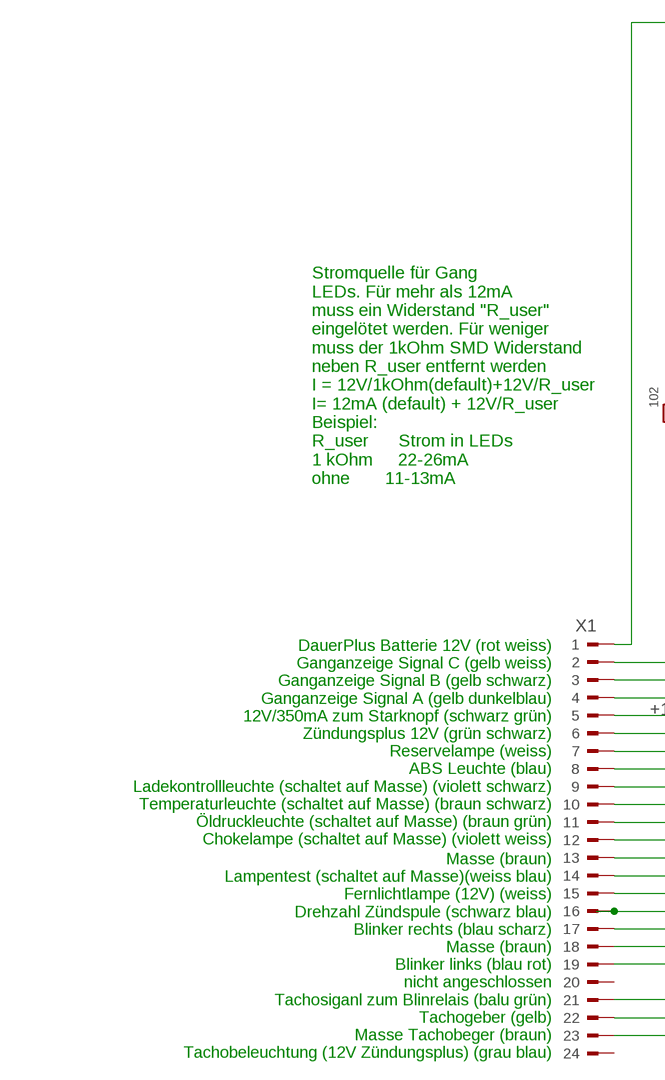
[diagram p12: schematic, sheet 7, part 1 of 2]
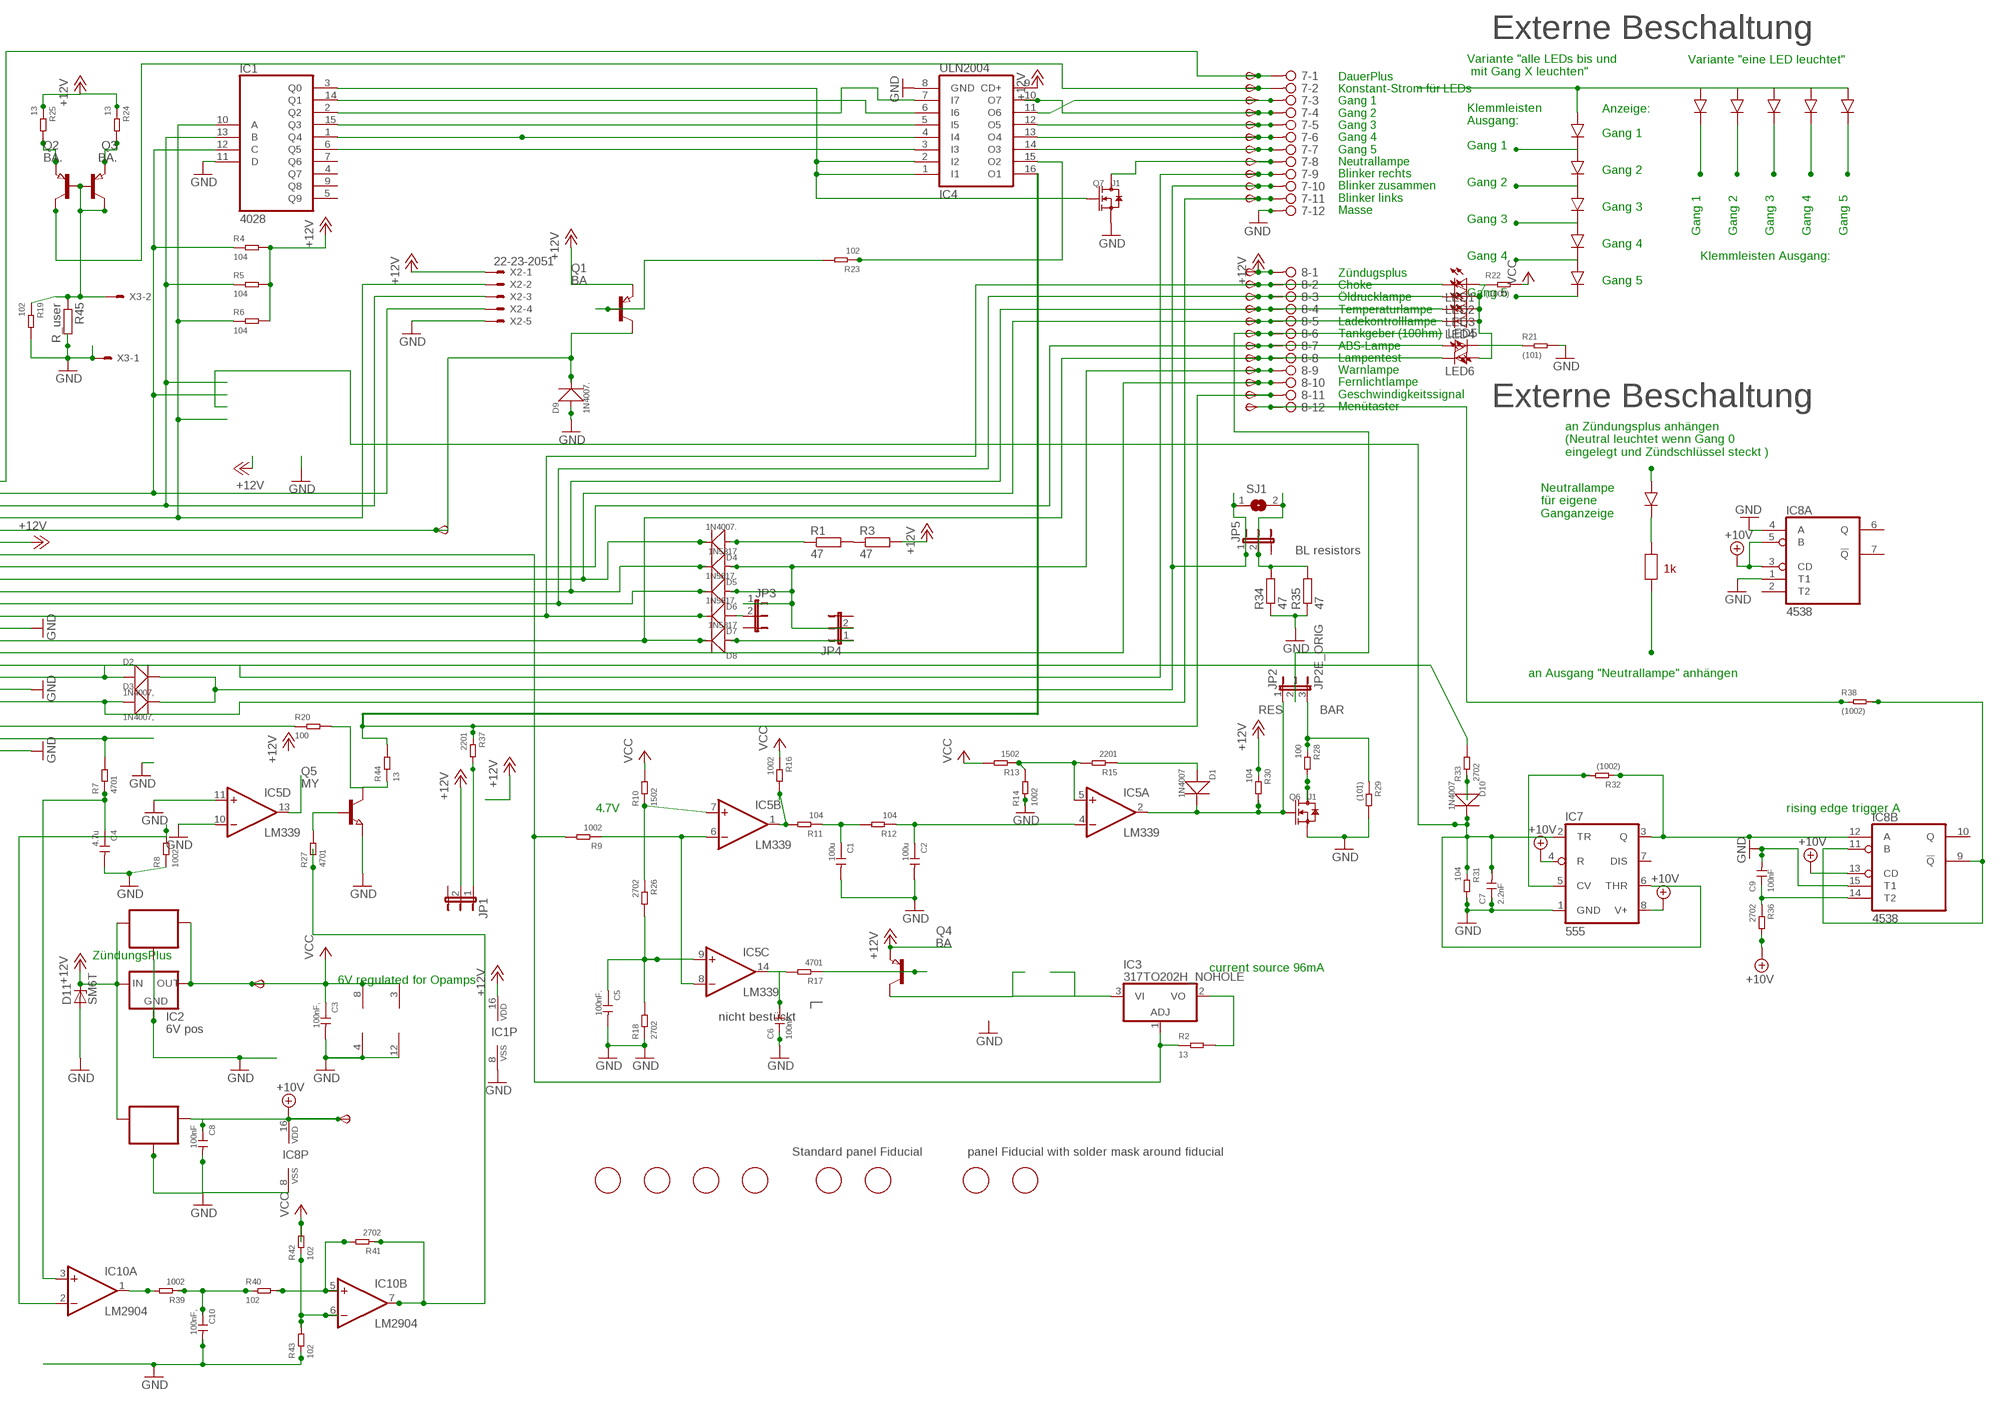
[diagram p13: schematic, sheet 7, part 2 of 2]

### Parts
6V1  TPSB2.0  [B2.0]
7  2081-1132  [12-PIN]
8  2081-1132  [12-PIN]
10V1  TPSB2.0  [B2.0]
C1  100u  CERAMIC-100UF-6.3V-20%-X5R(1206)  [C1206]
C2  100u  CERAMIC-100UF-6.3V-20%-X5R(1206)  [C1206]
C3  100nF,  CERAMIC-100NF-50V-10%-X7R(0805)  [C0805]
C4  4.7u  CERAMIC-4.7UF-25V-10%-X5R(0805)  [C0805]
C5  100nF.  CERAMIC-100NF-50V-10%-X7R(0805)  [C0805]
C6  100nF.  CERAMIC-100NF-50V-10%-X7R(0805)  [C0805]
C7  2.2nF  CERAMIC-100NF-50V-10%-X7R(0805)  [C0805]
C8  100nF  CERAMIC-100NF-50V-10%-X7R(0805)  [C0805]
C9  100nF  CERAMIC-100NF-50V-10%-X7R(0805)  [C0805]
C10  100nF,  CERAMIC-100NF-50V-10%-X7R(0805)  [C0805]
D1  1N4007  DIODE-GEN-PURPOSE-1KV-1A(DO-214AC)  [DO-214AC]
D2  1N4007,  DIODE-GEN-PURPOSE-1KV-1A(DO-214AC)  [DO-214AC]
D3  1N4007,  DIODE-GEN-PURPOSE-1KV-1A(DO-214AC)  [DO-214AC]
D4  1N4007.  DIODE-GEN-PURPOSE-1KV-1A(DO-214AC)  [DO-214AC]
D5  1N5817  DIODE-GEN-PURPOSE-1KV-1A(DO-214AC)DO-214AC/1206  [DO-214AC_SLIM]
D6  1N5817.  DIODE-GEN-PURPOSE-1KV-1A(DO-214AC)DO-214AC/1206  [DO-214AC_SLIM]
D7  1N5817.  DIODE-GEN-PURPOSE-1KV-1A(DO-214AC)DO-214AC/1206  [DO-214AC_SLIM]
D8  1N5817  DIODE-GEN-PURPOSE-1KV-1A(DO-214AC)DO-214AC/1206  [DO-214AC_SLIM]
D9  1N4007.  DIODE-GEN-PURPOSE-1KV-1A(DO-214AC)  [DO-214AC]
D10  1N4007  DIODE-GEN-PURPOSE-1KV-1A(DO-214AC)  [DO-214AC]
D11  SM6T  [DO214AA]
FID1B1  FIDUCIALFIDUCIAL_1MM_WITH_SOLDERMASK  [FIDUCIAL_1MM_WITH_SOLDERMASK]
FID2B1  FIDUCIALFIDUCIAL_1MM_WITH_SOLDERMASK  [FIDUCIAL_1MM_WITH_SOLDERMASK]
FID3  FIDUCIAL  [FIDUCIAL_1MM]
FID4  FIDUCIAL  [FIDUCIAL_1MM]
FID5  FIDUCIAL  [FIDUCIAL_1MM]
FID6  FIDUCIAL  [FIDUCIAL_1MM]
FID27  FIDUCIAL  [FIDUCIAL_1MM]
FID28  FIDUCIAL  [FIDUCIAL_1MM]
IC1  4028  4028D  [SO16]
IC2  6V pos  78LXX  [78LXX]
IC3  317TO202H_NOHOLE  [TO220H_NOHOLE]
IC4  ULN2004  ULN2004AD  [SO16]
IC5  LM339  LM339D  [SO14]
IC6  78L06  78LXXSOT89_ROUND  [SOT89_ROUND]
IC7  555  NE555D  [SO08]
IC8  4538  4538D  [SO16]
IC9  78L10  78LXXSOT89_ROUND  [SOT89_ROUND]
IC10  LM2904  LM358D  [SO08]
JP1  JP2EJP2_SMALLPADS  [JP2_SMALLPADS]
JP2  JP2E_ORIG  [JP2_ORIG_SMALLPADS]
JP3  JP2EJP2_SMALLPADS  [JP2_SMALLPADS]
JP4  JP2EJP2_SMALLPADS  [JP2_SMALLPADS]
JP5  JP2EJP2_SMALLPADS  [JP2_SMALLPADS]
LED1  LEDLD260  [LD260]
LED2  LEDLD260  [LD260]
LED3  LEDLD260  [LD260]
LED4  LEDLD260  [LD260]
LED5  LEDLD260  [LD260]
LED6  LEDLD260  [LD260]
Q1  BA  PNP-TRANSISTOR_SOT89  [SOT89]
Q2  BA.  PNP-TRANSISTOR_SOT89  [SOT89]
Q3  BA.  PNP-TRANSISTOR_SOT89  [SOT89]
Q4  BA  PNP-TRANSISTOR_SOT89  [SOT89]
Q5  MY  NPN-TRANSISTOR_SOT89  [SOT89]
Q6  J1  SMD-MOSFET-N-CH-50V-200MA-BSS138W-7-F(SOT-23)  [SOT-23]
Q7  J1  SMD-MOSFET-N-CH-50V-200MA-BSS138W-7-F(SOT-23)  [SOT-23]
R1  47  R-EU_V235/17_1MM  [V235/17_1MM]
R2  13  SMD-RES-13R-5%-1/4W(1206)  [R1206]
R3  47  R-EU_V235/17_1MM  [V235/17_1MM]
R4  104  SMD-RES-10K-1%-1/8W(0805)  [R0805]
R5  104  SMD-RES-10K-1%-1/8W(0805)  [R0805]
R6  104  SMD-RES-10K-1%-1/8W(0805)  [R0805]
R7  4701  SMD-RES-4.7K-5%-1/8W(0805)  [R0805]
R8  1002  SMD-RES-10K-1%-1/8W(0805)  [R0805]
R9  1002  SMD-RES-10K-1%-1/8W(0805)  [R0805]
R10  1502  SMD-RES-10K-1%-1/8W(0805)  [R0805]
R11  104  SMD-RES-10K-1%-1/8W(0805)  [R0805]
R12  104  SMD-RES-10K-1%-1/8W(0805)  [R0805]
R13  1502  SMD-RES-10K-1%-1/8W(0805)  [R0805]
R14  1002  SMD-RES-10K-1%-1/8W(0805)  [R0805]
R15  2201  SMD-RES-2.2K-5%-1/8W(0805)  [R0805]
R16  1002  SMD-RES-10K-1%-1/8W(0805)  [R0805]
R17  4701  SMD-RES-4.7K-5%-1/8W(0805)  [R0805]
R18  2702  SMD-RES-4.7K-5%-1/8W(0805)  [R0805]
R19  102  SMD-RES-1K-5%-1/8W(0805)  [R0805]
R20  100  SMD-RES-220R-5%-1/8W(0805)  [R0805]
R21  (101)  SMD-RES-100R-5%-1/8W(0805)  [R0805]
R22  (1000)  SMD-RES-100R-5%-1/8W(0805)  [R0805]
R23  102  SMD-RES-1K-5%-1/8W(0805)  [R0805]
R24  13  SMD-RES-13R-5%-1/4W(1206)  [R1206]
R25  13  SMD-RES-13R-5%-1/4W(1206)  [R1206]
R26  2702  SMD-RES-4.7K-5%-1/8W(0805)  [R0805]
R27  4701  SMD-RES-4.7K-5%-1/8W(0805)  [R0805]
R28  100  SMD-RES-2.2K-5%-1/8W(0805)  [R0805]
R29  (101)  SMD-RES-2.2K-5%-1/8W(0805)  [R0805]
R30  104  SMD-RES-10K-1%-1/8W(0805)  [R0805]
R31  104  SMD-RES-10K-1%-1/8W(0805)  [R0805]
R32  (1002)  SMD-RES-10K-1%-1/8W(0805)  [R0805]
R33  2702  SMD-RES-10K-1%-1/8W(0805)  [R0805]
R34  47  R-EU_V235/17_1MM  [V235/17_1MM]
R35  47  R-EU_V235/17_1MM  [V235/17_1MM]
R36  2702  SMD-RES-4.7K-5%-1/8W(0805)  [R0805]
R37  2201  SMD-RES-2.2K-5%-1/8W(0805)  [R0805]
R38  (1002)  SMD-RES-4.7K-5%-1/8W(0805)  [R0805]
R39  1002  SMD-RES-10K-1%-1/8W(0805)  [R0805]
R40  102  SMD-RES-1K-5%-1/8W(0805)  [R0805]
R41  2702  SMD-RES-4.7K-5%-1/8W(0805)  [R0805]
R42  102  SMD-RES-1K-5%-1/8W(0805)  [R0805]
R43  102  SMD-RES-1K-5%-1/8W(0805)  [R0805]
R44  13  SMD-RES-13R-5%-1/4W(1206)  [R1206]
R45  R_user  R-EU_R0805  [R0805]
SJ1  SJ  [SJ]
START1  TPSB2.0  [B2.0]
TP70  TPSB2.0  [B2.0]
TP71  TPSB2.0  [B2.0]
TP72  TPSB2.0  [B2.0]
TP73  TPSB2.0  [B2.0]
TP74  TPSB2.0  [B2.0]
TP75  TPSB2.0  [B2.0]
TP76  TPSB2.0  [B2.0]
TP77  TPSB2.0  [B2.0]
TP78  TPSB2.0  [B2.0]
TP79  TPSB2.0  [B2.0]
TP80  TPSB2.0  [B2.0]
TP81  TPSB2.0  [B2.0]
TP82  TPSB2.0  [B2.0]
TP83  TPSB2.0  [B2.0]
TP84  TPSB2.0  [B2.0]
TP85  TPSB2.0  [B2.0]
TP86  TPSB2.0  [B2.0]
TP87  TPSB2.0  [B2.0]
TP88  TPSB1,27  [B1,27]
TP89  TPSB2.0  [B2.0]
TP90  TPSB2.0  [B2.0]
TP91  TPSB2.0  [B2.0]
TP92  TPSB2.0  [B2.0]
X1  CON_BMWV2  [24-PIN_V2]
X2  22-23-2051  [22-23-2051]
X3  22-23-2021  [22-23-2021]

### Nets
+10V: 10V1.TP(PP) C8.1 IC7.4(R) IC7.8(V+) IC8.3(A:CD) IC8.5(A:B) IC8.13(B:CD) IC8.16(P:VDD) IC9.1(OUT) R36.2 ; also sheet 1,2,3,4,5,6,8,9,10,11,12
+12V: 8.1 D11.C IC1.16(VDD) IC2.IN IC4.9(CD+) IC6.3(IN) IC9.3(IN) JP1.2 Q1.3(E) Q4.3(E) R3.2 R4.2 R5.2 R6.2 R24.1 R25.1 R30.1 TP91.TP(PP) X1.6 X2.1 ; also sheet 1,2,3,4,5,6,8,9,10,11,12
+12V4: IC10.7(B:OUT) R27.1 R41.1
GND: 7.12 C1.2 C2.2 C3.2 C4.2 C5.2 C6.1 C7.1 C8.2 C9.2 C10.2 D9.1(+) D11.A IC1.8(VSS) IC1.11(D) IC2.GND IC4.8(GND) IC5.10(D:-IN) IC5.11(D:+IN) IC5.12(P:GND) IC6.2(GND) IC6.2@1(GND) IC7.1(GND) IC8.1(A:T1) IC8.4(A:A) IC8.8(P:VSS) IC8.15(B:T1) IC9.2(GND) IC9.2@1(GND) IC10.4(P:V-) Q5.3(E) Q6.2(S) Q7.2(S) R8.1 R14.1 R18.1 R19.2 R21.2 R29.2 R31.2 R34.1 R35.1 R43.1 R45.2 X1.13 X1.18 X1.23 X2.5 X3.1 ; also sheet 1,2,3,4,5,6,8,9,10,11,12
N$297: R1.2 R3.1
N$298: 8.9 D5.1(+) D6.1(+) JP3.1 JP4.2 TP88.TP(PP)
N$299: IC1.10(A) R6.1 X1.4 X2.2
N$300: IC1.13(B) R5.1 X1.3 X2.3
N$301: D9.2(-) Q1.2(C) START1.TP(PP) X1.5
N$302: IC1.12(C) R4.1 X1.2 X2.4
N$303: 8.7 LED5.A TP86.TP(PP) X1.8
N$304: 8.2 D7.2(-) LED1.K(C) TP81.TP(PP) X1.12
N$305: 8.3 D6.2(-) LED2.K(C) TP82.TP(PP) X1.11
N$306: 8.4 D5.2(-) LED3.K(C) TP83.TP(PP) X1.10
N$307: 8.8 D8.2(-) LED6.K(C) TP87.TP(PP) X1.14
N$308: 7.9 D2.1(+) TP78.TP(PP) X1.17
N$309: 7.11 D3.1(+) TP80.TP(PP) X1.19
N$310: R7.2 X1.22
N$311: C4.1 IC10.3(A:+IN) R7.1
N$312: 8.11 IC4.16(O1) R37.1 R44.2 TP90.TP(PP)
N$313: IC5.1(B:OUT) R11.2 R16.2
N$314: C1.1 R11.1 R12.2
N$315: C2.1 IC5.4(A:-IN) R12.1
N$316: IC5.5(A:+IN) R13.1 R14.2 R15.2
N$317: D1.1(+) R15.1
N$318: C5.1 IC5.9(C:+IN) R18.2 R26.2
N$319: C6.2 IC5.14(C:OUT) R17.2
N$320: Q4.1(B) R17.1
N$321: IC1.2(Q2) IC4.7(I7)
N$322: 7.5 IC4.12(O5) TP74.TP(PP)
N$323: IC1.1(Q4) IC4.4(I4)
N$324: 7.8 Q7.3(D) TP77.TP(PP)
N$325: 8.10 TP89.TP(PP) X1.15
N$326: 8.5 D4.2(-) LED4.K(C) TP84.TP(PP) X1.9
N$327: D4.1(+) R1.1
N$328: IC1.6(Q5) IC4.3(I3)
N$329: 7.4 IC4.10(O7) TP73.TP(PP)
N$330: IC3.1(ADJ) R2.1 R9.2 X1.7
N$331: IC5.6(B:-IN) IC5.8(C:-IN) R9.1
N$332: 7.2 Q3.2(C) TP71.TP(PP)
N$333: 7.1 TP70.TP(PP) X1.1
N$347: R33.2 X1.16
N$348: IC1.15(Q3) IC4.5(I5)
N$349: 7.6 IC4.13(O4) TP75.TP(PP)
N$350: 7.7 IC4.14(O3) TP76.TP(PP)
N$351: 8.6 JP2.2 TP85.TP(PP)
N$352: LED5.K(C) R21.1
N$353: LED1.A LED2.A LED3.A LED4.A LED6.A R22.1
N$354: Q1.1(B) R23.2
N$355: IC1.3(Q0) IC4.1(I1) IC4.2(I2) Q7.1(G)
N$356: IC1.14(Q1) IC4.6(I6)
N$357: 7.3 IC4.11(O6) TP72.TP(PP)
N$358: Q2.1(B) Q2.2(C) Q3.1(B) R19.1 R45.1 X3.2
N$359: Q3.3(E) R25.2
N$360: Q2.3(E) R24.2
N$361: IC5.7(B:+IN) R10.1 R26.1
N$362: IC10.2(A:-IN) R8.2
N$363: Q5.1(B) R27.2
N$364: Q6.3(D) R28.2
N$365: IC3.2(VO) R2.2
N$366: IC3.3(VI) Q4.2(C)
N$367: C7.2 D10.2(-) IC7.2(TR) IC7.6(THR) R31.1
N$368: IC7.5(CV) R32.2
N$369: IC7.3(Q) IC8.12(B:A) R32.1
N$370: D10.1(+) R33.1
N$371: 7.10 D2.2(-) D3.2(-) JP5.1 SJ1.1 TP79.TP(PP)
N$372: JP5.2 R34.2 R35.2 SJ1.2
N$373: IC8.9(B:!Q) IC8.11(B:B) R38.2
N$374: C9.1 IC8.14(B:T2) R36.1
N$375: JP1.1 R37.2
N$376: IC4.15(O2) R23.1
N$377: 8.12 R38.1 TP92.TP(PP)
N$378: D7.1(+) JP3.2
N$379: D1.2(-) IC5.2(A:OUT) JP2.1 Q6.1(G) R30.2
N$380: IC10.1(A:OUT) R39.2
N$381: C10.1 R39.1 R40.1
N$382: IC10.5(B:+IN) R40.2 R41.2
N$383: IC10.6(B:-IN) R42.1 R43.2
N$384: D8.1(+) JP4.1
N$385: JP2.3 R28.1 R29.1
N$386: IC5.13(D:OUT)
N$387: R20.1 X1.21
N$388: Q5.2(C) R20.2 R44.1
VCC: 6V1.TP(PP) C3.1 IC2.OUT IC5.3(P:V+) IC6.1(OUT) IC10.8(P:V+) R10.2 R13.2 R16.1 R22.2 R42.2 ; also sheet 1,2,3,4,5,6,8,9,10,11,12
Unconnected: IC1.4(Q7) IC1.5(Q9) IC1.7(Q6) IC1.9(Q8) IC7.7(DIS) IC8.2(A:T2) IC8.6(A:Q) IC8.7(A:!Q) IC8.10(B:Q) X1.20 X1.24

### Notes on the sheet
- Externe Beschaltung
- Variante "eine LED leuchtet"
- Variante "alle LEDs bis und
   mit Gang X leuchten"
- Anzeige:
- Klemmleisten
  Ausgang:
- Gang 1
- DauerPlus
  Konstant-Strom für LEDs
  Gang 1
  Gang 2
  Gang 3
  Gang 4
  Gang 5
  Neutrallampe
  Blinker rechts
  Blinker zusammen
  Blinker links
  Masse
- Gang 1
- Gang 2
- Gang 2
- Gang 3
- Gang 3
- Gang 1 | Gang 2 | Gang 3 | Gang 4 | Gang 5
- Gang 4
- Gang 4 | Klemmleisten Ausgang:
- Gang 5
- Gang 5
- Zündugsplus
  Choke
  Öldrucklampe
  Temperaturlampe
  Ladekontrolllampe
  Tankgeber (100hm)
  ABS-Lampe
  Lampentest
  Warnlampe
  Fernlichtlampe
  Geschwindigkeitssignal
  Menütaster
- Stromquelle für Gang
  LEDs. Für mehr als 12mA
  muss ein Widerstand "R_user"
  eingelötet werden. Für weniger
  muss der 1kOhm SMD Widerstand
  neben R_user entfernt werden
  I = 12V/1kOhm(default)+12V/R_user
  I= 12mA (default) + 12V/R_user
  Beispiel:
  R_user      Strom in LEDs
  1 kOhm     22-26mA
  ohne       11-13mA
- Externe Beschaltung
- an Zündungsplus anhängen
  (Neutral leuchtet wenn Gang 0
  eingelegt und Zündschlüssel steckt )
- Neutrallampe
  für eigene
  Ganganzeige
- DauerPlus Batterie 12V (rot weiss)
  Ganganzeige Signal C (gelb weiss)
  Ganganzeige Signal B (gelb schwarz)
  Ganganzeige Signal A (gelb dunkelblau)
  12V/350mA zum Starknopf (schwarz grün)
  Zündungsplus 12V (grün schwarz)
  Reservelampe (weiss)
  ABS Leuchte (blau)
  Ladekontrollleuchte (schaltet auf Masse) (violett schwarz)
  Temperaturleuchte (schaltet auf Masse) (braun schwarz)
  Öldruckleuchte (schaltet auf Masse) (braun grün)
  Chokelampe (schaltet auf Masse) (violett weiss)
- BL resistors
- 1k
- an Ausgang "Neutrallampe" anhängen
- Masse (braun)
  Lampentest (schaltet auf Masse)(weiss blau)
  Fernlichtlampe (12V) (weiss)
  Drehzahl Zündspule (schwarz blau)
  Blinker rechts (blau scharz)
  Masse (braun)
  Blinker links (blau rot)
  nicht angeschlossen
  Tachosiganl zum Blinrelais (balu grün)
  Tachogeber (gelb)
  Masse Tachobeger (braun)
  Tachobeleuchtung (12V Zündungsplus) (grau blau)
- RES | BAR
- 4.7V | rising edge trigger A
- ZündungsPlus
- current source 96mA
- 6V regulated for Opamps
- nicht bestückt
- Standard panel Fiducial | panel Fiducial with solder mask around fiducial

## Sheet 8 of 12
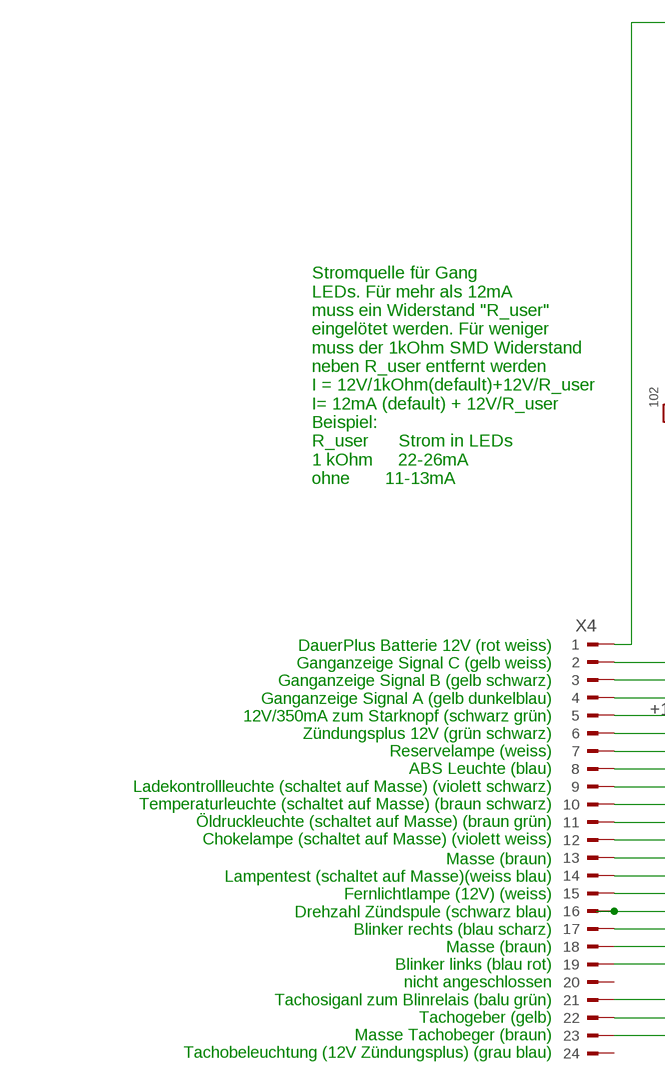
[diagram p14: schematic, sheet 8, part 1 of 2]
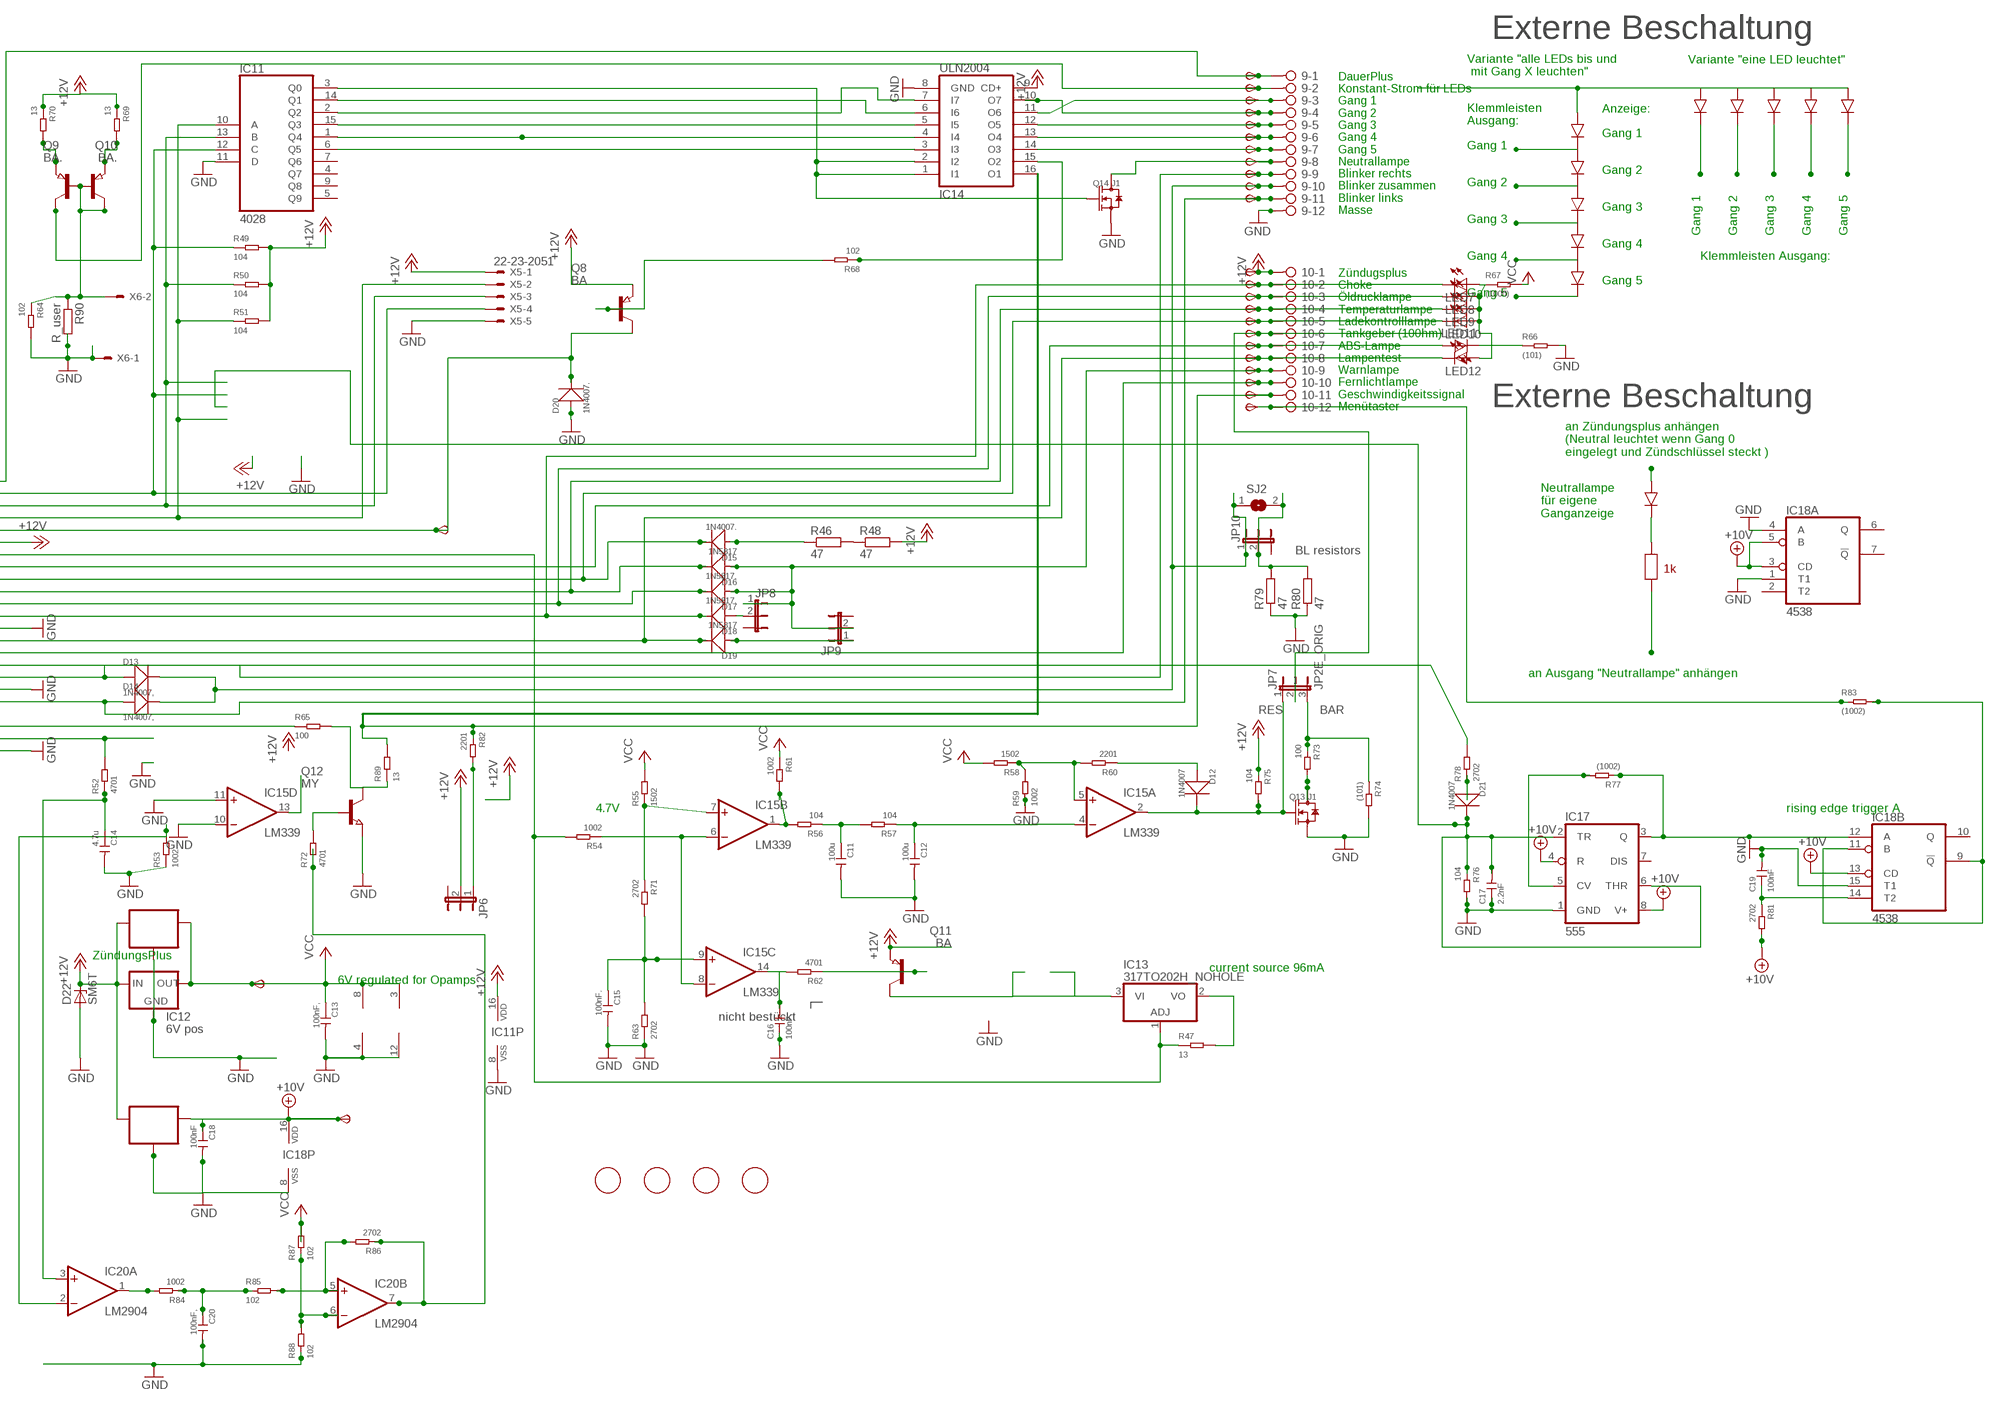
[diagram p15: schematic, sheet 8, part 2 of 2]

### Parts
6V2  TPSB2.0  [B2.0]
9  2081-1132  [12-PIN]
10  2081-1132  [12-PIN]
10V2  TPSB2.0  [B2.0]
C11  100u  CERAMIC-100UF-6.3V-20%-X5R(1206)  [C1206]
C12  100u  CERAMIC-100UF-6.3V-20%-X5R(1206)  [C1206]
C13  100nF,  CERAMIC-100NF-50V-10%-X7R(0805)  [C0805]
C14  4.7u  CERAMIC-4.7UF-25V-10%-X5R(0805)  [C0805]
C15  100nF.  CERAMIC-100NF-50V-10%-X7R(0805)  [C0805]
C16  100nF.  CERAMIC-100NF-50V-10%-X7R(0805)  [C0805]
C17  2.2nF  CERAMIC-100NF-50V-10%-X7R(0805)  [C0805]
C18  100nF  CERAMIC-100NF-50V-10%-X7R(0805)  [C0805]
C19  100nF  CERAMIC-100NF-50V-10%-X7R(0805)  [C0805]
C20  100nF,  CERAMIC-100NF-50V-10%-X7R(0805)  [C0805]
D12  1N4007  DIODE-GEN-PURPOSE-1KV-1A(DO-214AC)  [DO-214AC]
D13  1N4007,  DIODE-GEN-PURPOSE-1KV-1A(DO-214AC)  [DO-214AC]
D14  1N4007,  DIODE-GEN-PURPOSE-1KV-1A(DO-214AC)  [DO-214AC]
D15  1N4007.  DIODE-GEN-PURPOSE-1KV-1A(DO-214AC)  [DO-214AC]
D16  1N5817  DIODE-GEN-PURPOSE-1KV-1A(DO-214AC)DO-214AC/1206  [DO-214AC_SLIM]
D17  1N5817.  DIODE-GEN-PURPOSE-1KV-1A(DO-214AC)DO-214AC/1206  [DO-214AC_SLIM]
D18  1N5817.  DIODE-GEN-PURPOSE-1KV-1A(DO-214AC)DO-214AC/1206  [DO-214AC_SLIM]
D19  1N5817  DIODE-GEN-PURPOSE-1KV-1A(DO-214AC)DO-214AC/1206  [DO-214AC_SLIM]
D20  1N4007.  DIODE-GEN-PURPOSE-1KV-1A(DO-214AC)  [DO-214AC]
D21  1N4007  DIODE-GEN-PURPOSE-1KV-1A(DO-214AC)  [DO-214AC]
D22  SM6T  [DO214AA]
FID7  FIDUCIAL  [FIDUCIAL_1MM]
FID8  FIDUCIAL  [FIDUCIAL_1MM]
FID9  FIDUCIAL  [FIDUCIAL_1MM]
FID10  FIDUCIAL  [FIDUCIAL_1MM]
IC11  4028  4028D  [SO16]
IC12  6V pos  78LXX  [78LXX]
IC13  317TO202H_NOHOLE  [TO220H_NOHOLE]
IC14  ULN2004  ULN2004AD  [SO16]
IC15  LM339  LM339D  [SO14]
IC16  78L06  78LXXSOT89_ROUND  [SOT89_ROUND]
IC17  555  NE555D  [SO08]
IC18  4538  4538D  [SO16]
IC19  78L10  78LXXSOT89_ROUND  [SOT89_ROUND]
IC20  LM2904  LM358D  [SO08]
JP6  JP2EJP2_SMALLPADS  [JP2_SMALLPADS]
JP7  JP2E_ORIG  [JP2_ORIG_SMALLPADS]
JP8  JP2EJP2_SMALLPADS  [JP2_SMALLPADS]
JP9  JP2EJP2_SMALLPADS  [JP2_SMALLPADS]
JP10  JP2EJP2_SMALLPADS  [JP2_SMALLPADS]
LED7  LEDLD260  [LD260]
LED8  LEDLD260  [LD260]
LED9  LEDLD260  [LD260]
LED10  LEDLD260  [LD260]
LED11  LEDLD260  [LD260]
LED12  LEDLD260  [LD260]
Q8  BA  PNP-TRANSISTOR_SOT89  [SOT89]
Q9  BA.  PNP-TRANSISTOR_SOT89  [SOT89]
Q10  BA.  PNP-TRANSISTOR_SOT89  [SOT89]
Q11  BA  PNP-TRANSISTOR_SOT89  [SOT89]
Q12  MY  NPN-TRANSISTOR_SOT89  [SOT89]
Q13  J1  SMD-MOSFET-N-CH-50V-200MA-BSS138W-7-F(SOT-23)  [SOT-23]
Q14  J1  SMD-MOSFET-N-CH-50V-200MA-BSS138W-7-F(SOT-23)  [SOT-23]
R46  47  R-EU_V235/17_1MM  [V235/17_1MM]
R47  13  SMD-RES-13R-5%-1/4W(1206)  [R1206]
R48  47  R-EU_V235/17_1MM  [V235/17_1MM]
R49  104  SMD-RES-10K-1%-1/8W(0805)  [R0805]
R50  104  SMD-RES-10K-1%-1/8W(0805)  [R0805]
R51  104  SMD-RES-10K-1%-1/8W(0805)  [R0805]
R52  4701  SMD-RES-4.7K-5%-1/8W(0805)  [R0805]
R53  1002  SMD-RES-10K-1%-1/8W(0805)  [R0805]
R54  1002  SMD-RES-10K-1%-1/8W(0805)  [R0805]
R55  1502  SMD-RES-10K-1%-1/8W(0805)  [R0805]
R56  104  SMD-RES-10K-1%-1/8W(0805)  [R0805]
R57  104  SMD-RES-10K-1%-1/8W(0805)  [R0805]
R58  1502  SMD-RES-10K-1%-1/8W(0805)  [R0805]
R59  1002  SMD-RES-10K-1%-1/8W(0805)  [R0805]
R60  2201  SMD-RES-2.2K-5%-1/8W(0805)  [R0805]
R61  1002  SMD-RES-10K-1%-1/8W(0805)  [R0805]
R62  4701  SMD-RES-4.7K-5%-1/8W(0805)  [R0805]
R63  2702  SMD-RES-4.7K-5%-1/8W(0805)  [R0805]
R64  102  SMD-RES-1K-5%-1/8W(0805)  [R0805]
R65  100  SMD-RES-220R-5%-1/8W(0805)  [R0805]
R66  (101)  SMD-RES-100R-5%-1/8W(0805)  [R0805]
R67  (1000)  SMD-RES-100R-5%-1/8W(0805)  [R0805]
R68  102  SMD-RES-1K-5%-1/8W(0805)  [R0805]
R69  13  SMD-RES-13R-5%-1/4W(1206)  [R1206]
R70  13  SMD-RES-13R-5%-1/4W(1206)  [R1206]
R71  2702  SMD-RES-4.7K-5%-1/8W(0805)  [R0805]
R72  4701  SMD-RES-4.7K-5%-1/8W(0805)  [R0805]
R73  100  SMD-RES-2.2K-5%-1/8W(0805)  [R0805]
R74  (101)  SMD-RES-2.2K-5%-1/8W(0805)  [R0805]
R75  104  SMD-RES-10K-1%-1/8W(0805)  [R0805]
R76  104  SMD-RES-10K-1%-1/8W(0805)  [R0805]
R77  (1002)  SMD-RES-10K-1%-1/8W(0805)  [R0805]
R78  2702  SMD-RES-10K-1%-1/8W(0805)  [R0805]
R79  47  R-EU_V235/17_1MM  [V235/17_1MM]
R80  47  R-EU_V235/17_1MM  [V235/17_1MM]
R81  2702  SMD-RES-4.7K-5%-1/8W(0805)  [R0805]
R82  2201  SMD-RES-2.2K-5%-1/8W(0805)  [R0805]
R83  (1002)  SMD-RES-4.7K-5%-1/8W(0805)  [R0805]
R84  1002  SMD-RES-10K-1%-1/8W(0805)  [R0805]
R85  102  SMD-RES-1K-5%-1/8W(0805)  [R0805]
R86  2702  SMD-RES-4.7K-5%-1/8W(0805)  [R0805]
R87  102  SMD-RES-1K-5%-1/8W(0805)  [R0805]
R88  102  SMD-RES-1K-5%-1/8W(0805)  [R0805]
R89  13  SMD-RES-13R-5%-1/4W(1206)  [R1206]
R90  R_user  R-EU_R0805  [R0805]
SJ2  SJ  [SJ]
START2  TPSB2.0  [B2.0]
TP93  TPSB2.0  [B2.0]
TP94  TPSB2.0  [B2.0]
TP95  TPSB2.0  [B2.0]
TP96  TPSB2.0  [B2.0]
TP97  TPSB2.0  [B2.0]
TP98  TPSB2.0  [B2.0]
TP99  TPSB2.0  [B2.0]
TP100  TPSB2.0  [B2.0]
TP101  TPSB2.0  [B2.0]
TP102  TPSB2.0  [B2.0]
TP103  TPSB2.0  [B2.0]
TP104  TPSB2.0  [B2.0]
TP105  TPSB2.0  [B2.0]
TP106  TPSB2.0  [B2.0]
TP107  TPSB2.0  [B2.0]
TP108  TPSB2.0  [B2.0]
TP109  TPSB2.0  [B2.0]
TP110  TPSB2.0  [B2.0]
TP111  TPSB1,27  [B1,27]
TP112  TPSB2.0  [B2.0]
TP113  TPSB2.0  [B2.0]
TP114  TPSB2.0  [B2.0]
TP115  TPSB2.0  [B2.0]
X4  CON_BMWV2  [24-PIN_V2]
X5  22-23-2051  [22-23-2051]
X6  22-23-2021  [22-23-2021]

### Nets
+10V: 10V2.TP(PP) C18.1 IC17.4(R) IC17.8(V+) IC18.3(A:CD) IC18.5(A:B) IC18.13(B:CD) IC18.16(P:VDD) IC19.1(OUT) R81.2 ; also sheet 1,2,3,4,5,6,7,9,10,11,12
+12V: 10.1 D22.C IC11.16(VDD) IC12.IN IC14.9(CD+) IC16.3(IN) IC19.3(IN) JP6.2 Q8.3(E) Q11.3(E) R48.2 R49.2 R50.2 R51.2 R69.1 R70.1 R75.1 TP114.TP(PP) X4.6 X5.1 ; also sheet 1,2,3,4,5,6,7,9,10,11,12
+12V5: IC20.7(B:OUT) R72.1 R86.1
GND: 9.12 C11.2 C12.2 C13.2 C14.2 C15.2 C16.1 C17.1 C18.2 C19.2 C20.2 D20.1(+) D22.A IC11.8(VSS) IC11.11(D) IC12.GND IC14.8(GND) IC15.10(D:-IN) IC15.11(D:+IN) IC15.12(P:GND) IC16.2(GND) IC16.2@1(GND) IC17.1(GND) IC18.1(A:T1) IC18.4(A:A) IC18.8(P:VSS) IC18.15(B:T1) IC19.2(GND) IC19.2@1(GND) IC20.4(P:V-) Q12.3(E) Q13.2(S) Q14.2(S) R53.1 R59.1 R63.1 R64.2 R66.2 R74.2 R76.2 R79.1 R80.1 R88.1 R90.2 X4.13 X4.18 X4.23 X5.5 X6.1 ; also sheet 1,2,3,4,5,6,7,9,10,11,12
N$389: R46.2 R48.1
N$390: 10.9 D16.1(+) D17.1(+) JP8.1 JP9.2 TP111.TP(PP)
N$391: IC11.10(A) R51.1 X4.4 X5.2
N$392: IC11.13(B) R50.1 X4.3 X5.3
N$393: D20.2(-) Q8.2(C) START2.TP(PP) X4.5
N$394: IC11.12(C) R49.1 X4.2 X5.4
N$395: 10.7 LED11.A TP109.TP(PP) X4.8
N$396: 10.2 D18.2(-) LED7.K(C) TP104.TP(PP) X4.12
N$397: 10.3 D17.2(-) LED8.K(C) TP105.TP(PP) X4.11
N$398: 10.4 D16.2(-) LED9.K(C) TP106.TP(PP) X4.10
N$399: 10.8 D19.2(-) LED12.K(C) TP110.TP(PP) X4.14
N$400: 9.9 D13.1(+) TP101.TP(PP) X4.17
N$401: 9.11 D14.1(+) TP103.TP(PP) X4.19
N$402: R52.2 X4.22
N$403: C14.1 IC20.3(A:+IN) R52.1
N$404: 10.11 IC14.16(O1) R82.1 R89.2 TP113.TP(PP)
N$405: IC15.1(B:OUT) R56.2 R61.2
N$406: C11.1 R56.1 R57.2
N$407: C12.1 IC15.4(A:-IN) R57.1
N$408: IC15.5(A:+IN) R58.1 R59.2 R60.2
N$409: D12.1(+) R60.1
N$410: C15.1 IC15.9(C:+IN) R63.2 R71.2
N$411: C16.2 IC15.14(C:OUT) R62.2
N$412: Q11.1(B) R62.1
N$413: IC11.2(Q2) IC14.7(I7)
N$414: 9.5 IC14.12(O5) TP97.TP(PP)
N$415: IC11.1(Q4) IC14.4(I4)
N$416: 9.8 Q14.3(D) TP100.TP(PP)
N$417: 10.10 TP112.TP(PP) X4.15
N$418: 10.5 D15.2(-) LED10.K(C) TP107.TP(PP) X4.9
N$419: D15.1(+) R46.1
N$420: IC11.6(Q5) IC14.3(I3)
N$421: 9.4 IC14.10(O7) TP96.TP(PP)
N$422: IC13.1(ADJ) R47.1 R54.2 X4.7
N$423: IC15.6(B:-IN) IC15.8(C:-IN) R54.1
N$424: 9.2 Q10.2(C) TP94.TP(PP)
N$425: 9.1 TP93.TP(PP) X4.1
N$439: R78.2 X4.16
N$440: IC11.15(Q3) IC14.5(I5)
N$441: 9.6 IC14.13(O4) TP98.TP(PP)
N$442: 9.7 IC14.14(O3) TP99.TP(PP)
N$443: 10.6 JP7.2 TP108.TP(PP)
N$444: LED11.K(C) R66.1
N$445: LED7.A LED8.A LED9.A LED10.A LED12.A R67.1
N$446: Q8.1(B) R68.2
N$447: IC11.3(Q0) IC14.1(I1) IC14.2(I2) Q14.1(G)
N$448: IC11.14(Q1) IC14.6(I6)
N$449: 9.3 IC14.11(O6) TP95.TP(PP)
N$450: Q9.1(B) Q9.2(C) Q10.1(B) R64.1 R90.1 X6.2
N$451: Q10.3(E) R70.2
N$452: Q9.3(E) R69.2
N$453: IC15.7(B:+IN) R55.1 R71.1
N$454: IC20.2(A:-IN) R53.2
N$455: Q12.1(B) R72.2
N$456: Q13.3(D) R73.2
N$457: IC13.2(VO) R47.2
N$458: IC13.3(VI) Q11.2(C)
N$459: C17.2 D21.2(-) IC17.2(TR) IC17.6(THR) R76.1
N$460: IC17.5(CV) R77.2
N$461: IC17.3(Q) IC18.12(B:A) R77.1
N$462: D21.1(+) R78.1
N$463: 9.10 D13.2(-) D14.2(-) JP10.1 SJ2.1 TP102.TP(PP)
N$464: JP10.2 R79.2 R80.2 SJ2.2
N$465: IC18.9(B:!Q) IC18.11(B:B) R83.2
N$466: C19.1 IC18.14(B:T2) R81.1
N$467: JP6.1 R82.2
N$468: IC14.15(O2) R68.1
N$469: 10.12 R83.1 TP115.TP(PP)
N$470: D18.1(+) JP8.2
N$471: D12.2(-) IC15.2(A:OUT) JP7.1 Q13.1(G) R75.2
N$472: IC20.1(A:OUT) R84.2
N$473: C20.1 R84.1 R85.1
N$474: IC20.5(B:+IN) R85.2 R86.2
N$475: IC20.6(B:-IN) R87.1 R88.2
N$476: D19.1(+) JP9.1
N$477: JP7.3 R73.1 R74.1
N$478: IC15.13(D:OUT)
N$479: R65.1 X4.21
N$480: Q12.2(C) R65.2 R89.1
VCC: 6V2.TP(PP) C13.1 IC12.OUT IC15.3(P:V+) IC16.1(OUT) IC20.8(P:V+) R55.2 R58.2 R61.1 R67.2 R87.2 ; also sheet 1,2,3,4,5,6,7,9,10,11,12
Unconnected: IC11.4(Q7) IC11.5(Q9) IC11.7(Q6) IC11.9(Q8) IC17.7(DIS) IC18.2(A:T2) IC18.6(A:Q) IC18.7(A:!Q) IC18.10(B:Q) X4.20 X4.24

### Notes on the sheet
- Externe Beschaltung
- Variante "eine LED leuchtet"
- Variante "alle LEDs bis und
   mit Gang X leuchten"
- Anzeige:
- Klemmleisten
  Ausgang:
- Gang 1
- DauerPlus
  Konstant-Strom für LEDs
  Gang 1
  Gang 2
  Gang 3
  Gang 4
  Gang 5
  Neutrallampe
  Blinker rechts
  Blinker zusammen
  Blinker links
  Masse
- Gang 1
- Gang 2
- Gang 2
- Gang 3
- Gang 3
- Gang 1 | Gang 2 | Gang 3 | Gang 4 | Gang 5
- Gang 4
- Gang 4 | Klemmleisten Ausgang:
- Gang 5
- Gang 5
- Zündugsplus
  Choke
  Öldrucklampe
  Temperaturlampe
  Ladekontrolllampe
  Tankgeber (100hm)
  ABS-Lampe
  Lampentest
  Warnlampe
  Fernlichtlampe
  Geschwindigkeitssignal
  Menütaster
- Stromquelle für Gang
  LEDs. Für mehr als 12mA
  muss ein Widerstand "R_user"
  eingelötet werden. Für weniger
  muss der 1kOhm SMD Widerstand
  neben R_user entfernt werden
  I = 12V/1kOhm(default)+12V/R_user
  I= 12mA (default) + 12V/R_user
  Beispiel:
  R_user      Strom in LEDs
  1 kOhm     22-26mA
  ohne       11-13mA
- Externe Beschaltung
- an Zündungsplus anhängen
  (Neutral leuchtet wenn Gang 0
  eingelegt und Zündschlüssel steckt )
- Neutrallampe
  für eigene
  Ganganzeige
- DauerPlus Batterie 12V (rot weiss)
  Ganganzeige Signal C (gelb weiss)
  Ganganzeige Signal B (gelb schwarz)
  Ganganzeige Signal A (gelb dunkelblau)
  12V/350mA zum Starknopf (schwarz grün)
  Zündungsplus 12V (grün schwarz)
  Reservelampe (weiss)
  ABS Leuchte (blau)
  Ladekontrollleuchte (schaltet auf Masse) (violett schwarz)
  Temperaturleuchte (schaltet auf Masse) (braun schwarz)
  Öldruckleuchte (schaltet auf Masse) (braun grün)
  Chokelampe (schaltet auf Masse) (violett weiss)
- BL resistors
- 1k
- an Ausgang "Neutrallampe" anhängen
- Masse (braun)
  Lampentest (schaltet auf Masse)(weiss blau)
  Fernlichtlampe (12V) (weiss)
  Drehzahl Zündspule (schwarz blau)
  Blinker rechts (blau scharz)
  Masse (braun)
  Blinker links (blau rot)
  nicht angeschlossen
  Tachosiganl zum Blinrelais (balu grün)
  Tachogeber (gelb)
  Masse Tachobeger (braun)
  Tachobeleuchtung (12V Zündungsplus) (grau blau)
- RES | BAR
- 4.7V | rising edge trigger A
- ZündungsPlus
- current source 96mA
- 6V regulated for Opamps
- nicht bestückt